# Altium project PROC114E3_SCH.PrjPcb (part 4 of 22)

## Sheet 13.SchDoc
size 513 x 386 mm
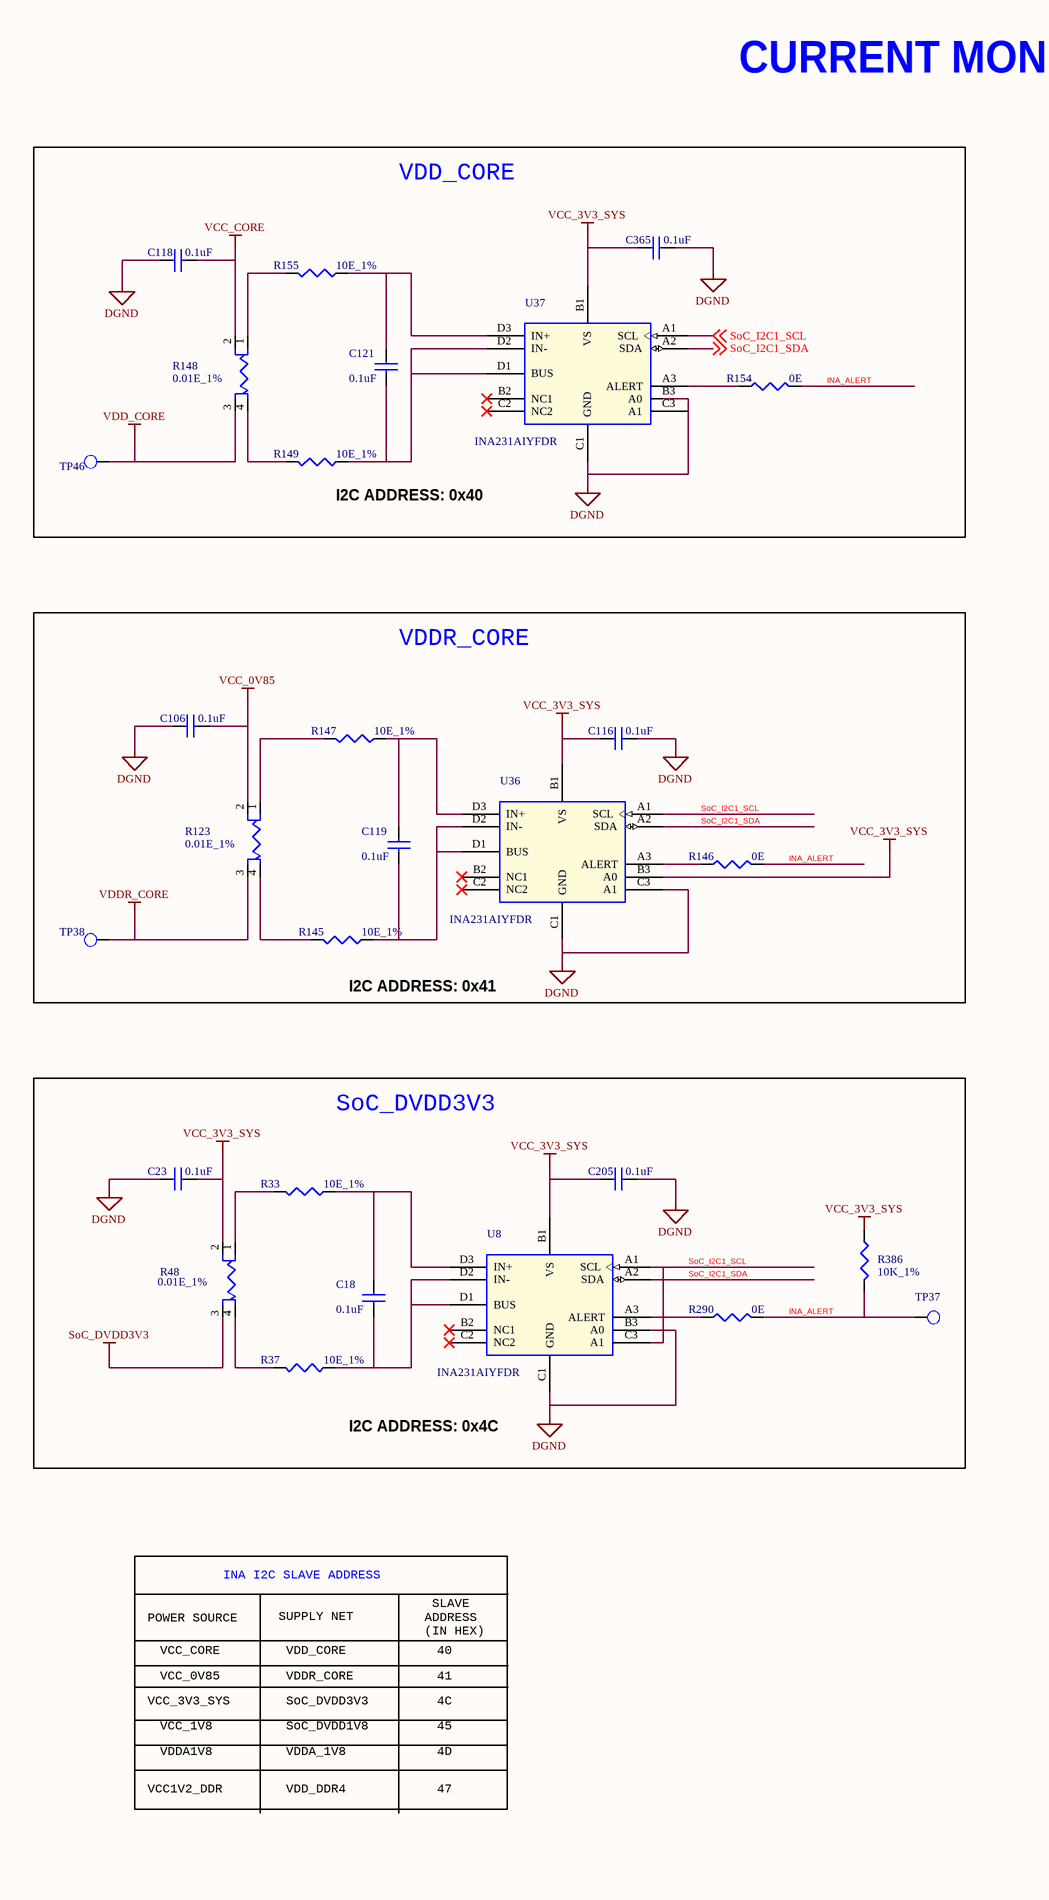
[diagram p15: 13.SchDoc, left]
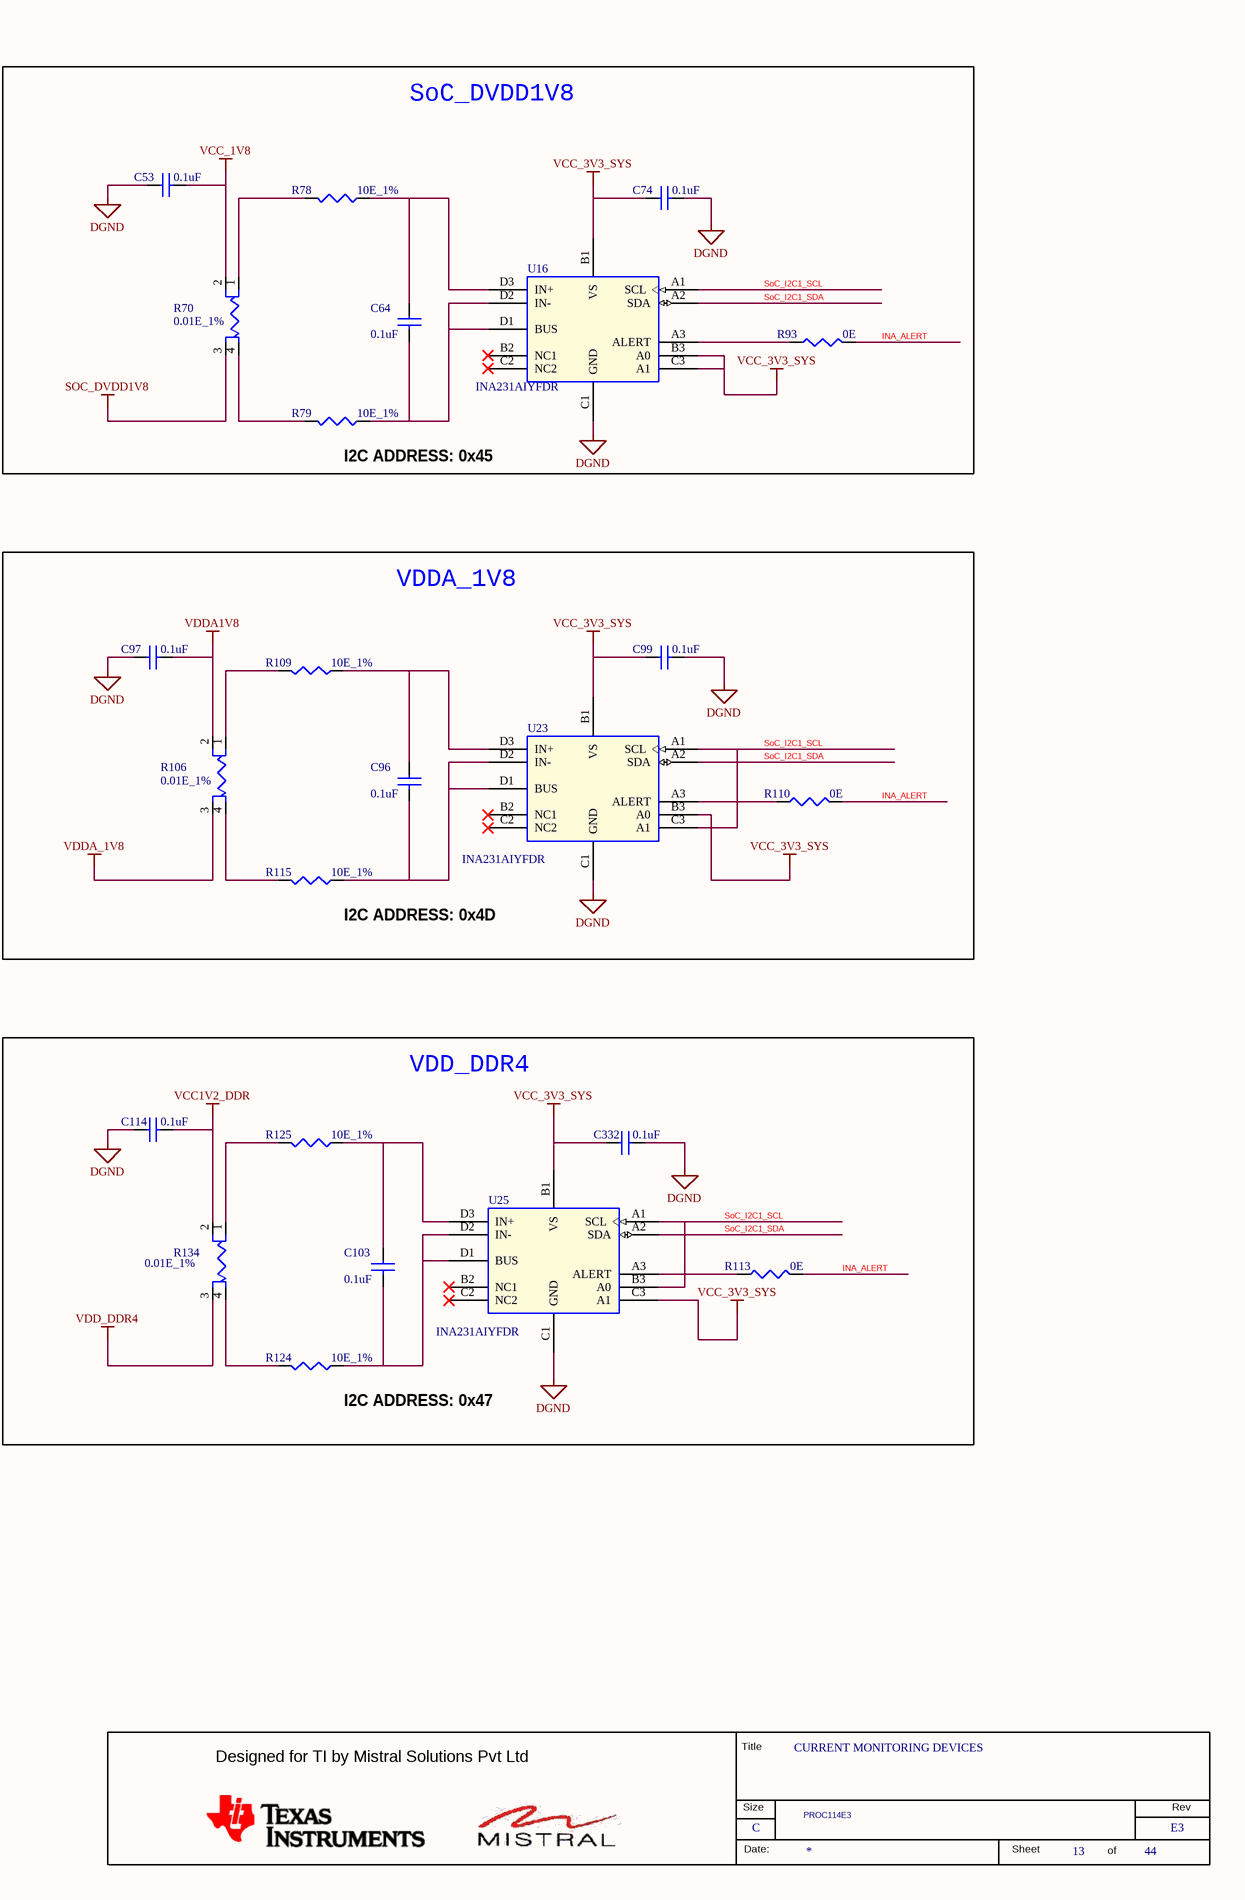
[diagram p16: 13.SchDoc, right]

### Parts
(Parts that share a designator on the sheet are numbered #1, #2 ... from top to bottom, then left to right.)
*#13  RevCode: E3  Title: CURRENT MONITORING DEVICES  Page Size: C  Page Number: 13  Page Count: 44  Variant Name: PROC114E3  (hidden comment: MISTRAL_TITLEBLK_CSIZE)  (graphical)
C18  0.1uF  [CAP0402_0-75]
C23  0.1uF  [CAP0402_0-75]
C53  0.1uF  [CAP0402_0-75]
C64  0.1uF  [CAP0402_0-75]
C74  0.1uF  [CAP0402_0-75]
C96  0.1uF  [CAP0402_0-75]
C97  0.1uF  [CAP0402_0-75]
C99  0.1uF  [CAP0402_0-75]
C103  0.1uF  [CAP0402_0-75]
C106  0.1uF  [CAP0402_0-75]
C114  0.1uF  [CAP0402_0-75]
C116  0.1uF  [CAP0402_0-75]
C118  0.1uF  [CAP0402_0-75]
C119  0.1uF  [CAP0402_0-75]
C121  0.1uF  [CAP0402_0-75]
C205  0.1uF  [CAP0402_0-75]
C332  0.1uF  [CAP0402_0-75]
C365  0.1uF  [CAP0402_0-75]
R33  10E_1%  [RES0402_0-5]
R37  10E_1%  [RES0402_0-5]
R48  0.01E_1%  [RES_KRL3216T4_1206-4_0-7]
R70  0.01E_1%  [RES_KRL3216T4_1206-4_0-7]
R78  10E_1%  [RES0402_0-5]
R79  10E_1%  [RES0402_0-5]
R93  0E  [RES0402_0-5]
R106  0.01E_1%  [RES_KRL3216T4_1206-4_0-7]
R109  10E_1%  [RES0402_0-5]
R110  0E  [RES0402_0-5]
R113  0E  [RES0402_0-5]
R115  10E_1%  [RES0402_0-5]
R123  0.01E_1%  [RES_KRL3216T4_1206-4_0-7]
R124  10E_1%  [RES0402_0-5]
R125  10E_1%  [RES0402_0-5]
R134  0.01E_1%  [RES_KRL3216T4_1206-4_0-7]
R145  10E_1%  [RES0402_0-5]
R146  0E  [RES0402_0-5]
R147  10E_1%  [RES0402_0-5]
R148  0.01E_1%  [RES_KRL3216T4_1206-4_0-7]
R149  10E_1%  [RES0402_0-5]
R154  0E  [RES0402_0-5]
R155  10E_1%  [RES0402_0-5]
R290  0E  [RES0402_0-5]
R386  10K_1%  [RES0402N]
TP37  TP20_SMD  [TP20_SMD]  (value not drawn)
TP38  TP20_SMD  [TP20_SMD]  (value not drawn)
TP46  TP20_SMD  [TP20_SMD]  (value not drawn)
U8  INA231AIYFDR  [DSBGA12_15-74_60X70_0-4]
U16  INA231AIYFDR  [DSBGA12_15-74_60X70_0-4]
U23  INA231AIYFDR  [DSBGA12_15-74_60X70_0-4]
U25  INA231AIYFDR  [DSBGA12_15-74_60X70_0-4]
U36  INA231AIYFDR  [DSBGA12_15-74_60X70_0-4]
U37  INA231AIYFDR  [DSBGA12_15-74_60X70_0-4]

### Blocks framed on the sheet
VDD_CORE: C118 C121 C365 R148 R149 R154 R155 TP46 U37
SoC_DVDD1V8: C53 C64 C74 R70 R78 R79 R93 U16
VDDR_CORE: C106 C116 C119 R123 R145-R147 TP38 U36
VDDA_1V8: C96 C97 C99 R106 R109 R110 R115 U23
SoC_DVDD3V3: C18 C23 C205 R33 R37 R48 R290 R386 TP37 U8
VDD_DDR4: C103 C114 C332 R113 R124 R125 R134 U25

### Nets
DGND: C23.1 C53.1 C74.2 C97.1 C99.2 C106.1 C114.1 C116.2 C118.1 C205.2 C332.2 C365.2 U8.B3(A0) U8.C1(GND) U16.C1(GND) U23.C1(GND) U25.C1(GND) U36.C1(GND) U36.C3(A1) U37.B3(A0) U37.C1(GND) U37.C3(A1)
SOC_DVDD1V8: R70.3
SoC_DVDD3V3: R48.3
VCC1V2_DDR: C114.2 R134.2
VCC_0V85: C106.2 R123.2
VCC_1V8: C53.2 R70.2
VCC_3V3_SYS: C23.2 C74.1 C99.1 C116.1 C205.1 C332.1 C365.1 R48.2 R386.2 U8.B1(VS) U16.B1(VS) U16.B3(A0) U16.C3(A1) U23.B1(VS) U23.B3(A0) U25.B1(VS) U25.C3(A1) U36.B1(VS) U36.B3(A0) U37.B1(VS)
VCC_CORE: C118.2 R148.2
VDD_CORE: R148.3 TP46.1(TP)
VDD_DDR4: R134.3
VDDA1V8: C97.2 R106.2
VDDA_1V8: R106.3
VDDR_CORE: R123.3 TP38.1(TP)
INA_ALERT: R93.2 R110.2 R113.2 R146.2 R154.2 R290.2 R386.1 TP37.1(TP)
SoC_I2C1_SCL: U8.A1(SCL) U8.C3(A1) U16.A1(SCL) U23.A1(SCL) U23.C3(A1) U25.A1(SCL) U25.B3(A0) U36.A1(SCL) U37.A1(SCL) ; off-sheet SoC_I2C1_SCL
SoC_I2C1_SDA: U8.A2(SDA) U16.A2(SDA) U23.A2(SDA) U25.A2(SDA) U36.A2(SDA) U37.A2(SDA) ; off-sheet SoC_I2C1_SDA
NetC18_1: C18.1 R33.1 U8.D3(IN+)
NetC18_2: C18.2 R37.1 U8.D1(BUS) U8.D2(IN-)
NetC64_1: C64.1 R78.1 U16.D3(IN+)
NetC64_2: C64.2 R79.1 U16.D1(BUS) U16.D2(IN-)
NetC96_1: C96.1 R109.1 U23.D3(IN+)
NetC96_2: C96.2 R115.1 U23.D1(BUS) U23.D2(IN-)
NetC103_1: C103.1 R125.1 U25.D3(IN+)
NetC103_2: C103.2 R124.1 U25.D1(BUS) U25.D2(IN-)
NetC119_1: C119.1 R147.1 U36.D3(IN+)
NetC119_2: C119.2 R145.1 U36.D1(BUS) U36.D2(IN-)
NetC121_1: C121.1 R155.1 U37.D3(IN+)
NetC121_2: C121.2 R149.1 U37.D1(BUS) U37.D2(IN-)
NetR33_2: R33.2 R48.1
NetR37_2: R37.2 R48.4
NetR70_1: R70.1 R78.2
NetR70_4: R70.4 R79.2
NetR93_1: R93.1 U16.A3(ALERT)
NetR106_1: R106.1 R109.2
NetR106_4: R106.4 R115.2
NetR110_1: R110.1 U23.A3(ALERT)
NetR113_1: R113.1 U25.A3(ALERT)
NetR123_1: R123.1 R147.2
NetR123_4: R123.4 R145.2
NetR124_2: R124.2 R134.4
NetR125_2: R125.2 R134.1
NetR146_1: R146.1 U36.A3(ALERT)
NetR148_1: R148.1 R155.2
NetR148_4: R148.4 R149.2
NetR154_1: R154.1 U37.A3(ALERT)
NetR290_1: R290.1 U8.A3(ALERT)

Not connected (* = marked no-connect by the designer): U8 B2(NC1)* C2(NC2)*; U16 B2(NC1)* C2(NC2)*; U23 B2(NC1)* C2(NC2)*; U25 B2(NC1)* C2(NC2)*; U36 B2(NC1)* C2(NC2)*; U37 B2(NC1)* C2(NC2)*

### Notes on the sheet
- CURRENT MONITORING DEVICES
- (near R149) I2C ADDRESS: 0x40
- (near R79) I2C ADDRESS: 0x45
- (near R145) I2C ADDRESS: 0x41
- (near R115) I2C ADDRESS: 0x4D
- I2C ADDRESS: 0x4C
- (near R124) I2C ADDRESS: 0x47
- INA I2C SLAVE ADDRESS
- SLAVE
  ADDRESS
  (IN HEX)
- POWER SOURCE
- VCC_CORE
- SUPPLY NET
- VDD_CORE
- 40
- VCC_3V3_SYS
- VCC_0V85
- VDDR_CORE
- SoC_DVDD3V3
- 41
- 4C
- VCC_1V8
- VDDA1V8
- SoC_DVDD1V8
- VDDA_1V8
- 45
- 4D
- VCC1V2_DDR
- VDD_DDR4
- 47
- (in symbol MISTRAL_TITLEBLK_CSIZE) Title; Designed for TI by Mistral Solutions Pvt Ltd; Size; Rev; Date:; Sheet; of

### Library data of the parts
*#13 = MISTRAL_TITLEBLK_CSIZE: Issue: 1.0; Page Create Date: March  8, 1995; Page Modify Date: *; Schematic Page Count: 44; Schematic Page Number: 13
C18 C23 C53 C96 C106 C114 C365 = CAP_Dup2: CAP CERAMIC 0.1uF 50V 10% X7R 0402; Alt_Mfr_part_number: CC0402KRX5R8BB104; Mistral Part No: 120011100014-R; Mfr_name: MURATA; Mfr_part_number: GRM155R71H104KE14D; Part_type: CAPACITORS\CERAMIC; Alt_Mfr_name: YAGEO AMERICA; Project: J7_CP; Wattage: NA; Customs_HS_Code: 85322990; Custom_Duty: 15%; PCB Footprint: CAP0402_0-75; Tolerance: 10%; Voltage: 50V; Package: 0402; Distributor_name: DIGIKEY; Distributor_part_number: 490-10700-1-ND; Height: 0.55MM; Weight: 3.1mg; Temperature: -55°C+125°C; Datasheet: Y:\MIS_DATABASE\DATASHEETS\CAPACITORS\GRM155R71H104KE14.PDF; Crtd /date: ALVY/211020; Chkd/date: MANIRAJA/261020; MECHANICAL 3D STEP FILE: CAP0402_0-75; Library Ref: CAP; Footprint Ref: CAP0402_0-75; Library Path: Y:\MIS_DATABASE\Library\ALTIUM_TOOL\SCHEMATICS_PARTS\MS_DISCRETE_Library.schlib; Footprint Path: Y:\MIS_DATABASE\Library\ALTIUM_TOOL\PCB_FOOTPRINTS\Altium_Footprint_Lib.PcbLib
C64 C74 C97 C99 C103 C116 C118 C119 C121 C205 C332 = CAP_Dup2: CAP CERAMIC 0.1uF 50V 10% X7R 0402; Alt_Mfr_name: YAGEO AMERICA; Part_type: CAPACITORS\CERAMIC; Mfr_part_number: GRM155R71H104KE14D; Mfr_name: MURATA; Mistral Part No: 120011100014-R; Alt_Mfr_part_number: CC0402KRX5R8BB104; Custom_Duty: 15%; Customs_HS_Code: 85322990; Wattage: NA; Project: J7_CP; PCB Footprint: CAP0402_0-75; Footprint Path: Y:\MIS_DATABASE\Library\ALTIUM_TOOL\PCB_FOOTPRINTS\Altium_Footprint_Lib.PcbLib; Library Path: Y:\MIS_DATABASE\Library\ALTIUM_TOOL\SCHEMATICS_PARTS\MS_DISCRETE_Library.schlib; Footprint Ref: CAP0402_0-75; Library Ref: CAP; MECHANICAL 3D STEP FILE: CAP0402_0-75; Chkd/date: MANIRAJA/261020; Crtd /date: ALVY/211020; Datasheet: Y:\MIS_DATABASE\DATASHEETS\CAPACITORS\GRM155R71H104KE14.PDF; Temperature: -55°C+125°C; Weight: 3.1mg; Height: 0.55MM; Distributor_part_number: 490-10700-1-ND; Distributor_name: DIGIKEY; Package: 0402; Voltage: 50V; Tolerance: 10%
R33 R37 R79 R115 R124 R147 R149 R155 = RESISTOR_Dup6: RES 10E 1/16W 1% 0402; Part_type: RESISTORS\FIXED; Mfr_part_number: RC0402FR-0710RL; Mfr_name: YAGEO AMERICA; Mistral Part No: 110018020004-R; Custom_Duty: 15%; Customs_HS_Code: 85332119; Voltage: NA; Project: TI_MAXIE_CPB; PCB Footprint: RES0402_0-5; Footprint Path: Y:\MIS_DATABASE\Library\ALTIUM_TOOL\PCB_FOOTPRINTS\Altium_Footprint_Lib.PcbLib; Library Path: Y:\MIS_DATABASE\Library\ALTIUM_TOOL\SCHEMATICS_PARTS\MS_DISCRETE_Library.schlib; Footprint Ref: RES0402_0-5; MECHANICAL 3D STEP FILE: RES0402_0-5; Chkd/date: MANIRAJA/070218; Crtd /date: ALVY/070218; Datasheet: Y:\MIS_DATABASE\DATASHEETS\RESISTORS\RCXXXXL-SER_MAR18.PDF; Temperature: -55°C+155°C; Weight: 0.65mg; Height: 0.40MM; Distributor_part_number: 311-10.0LRCT-ND; Distributor_name: DIGIKEY; Package: 0402; Wattage: 1/16W; Tolerance: 1%; Library Ref: RESISTOR
R48 R70 R106 = RESISTOR-4TERM: RES 0.01E 1W 1% 1206-4; Mistral Part No: 110018030003-R; Mfr_name: SUSUMU; Mfr_part_number: KRL3216T4A-M-R010-F-T1; Part_type: RESISTORS\FIXED; Project: GRACO SMART MODULE; Voltage: NA; Customs_HS_Code: 85332119; Custom_Duty: 15%; PCB Footprint: RES_KRL3216T4_1206-4_0-7; Library Ref: RESISTOR-4TERM; Tolerance: 1%; Wattage: 1W; Package: 1206-4; Distributor_name: DIGIKEY; Distributor_part_number: 408-1974-1-ND; Height: 0.70MM; Weight: 16.2mg; Temperature: -55°C+155°C; Datasheet: Y:\MIS_DATABASE\DATASHEETS\RESISTORS\KRL-SERIES.PDF; Crtd /date: MANIRAJA/060318; Chkd/date: MANIRAJA/060318; MECHANICAL 3D STEP FILE: RES_KRL3216T4_1206-4_0-7; Footprint Ref: RES_KRL3216T4_1206-4_0-7; Library Path: Y:\MIS_DATABASE\Library\ALTIUM_TOOL\SCHEMATICS_PARTS\MS_DISCRETE_Library.schlib; Footprint Path: Y:\MIS_DATABASE\Library\ALTIUM_TOOL\PCB_FOOTPRINTS\Altium_Footprint_Lib.PcbLib
R78 R109 R125 R145 = RESISTOR_Dup6: RES 10E 1/16W 1% 0402; Mistral Part No: 110018020004-R; Mfr_name: YAGEO AMERICA; Mfr_part_number: RC0402FR-0710RL; Part_type: RESISTORS\FIXED; Project: TI_MAXIE_CPB; Voltage: NA; Customs_HS_Code: 85332119; Custom_Duty: 15%; PCB Footprint: RES0402_0-5; Library Ref: RESISTOR; Tolerance: 1%; Wattage: 1/16W; Package: 0402; Distributor_name: DIGIKEY; Distributor_part_number: 311-10.0LRCT-ND; Height: 0.40MM; Weight: 0.65mg; Temperature: -55°C+155°C; Datasheet: Y:\MIS_DATABASE\DATASHEETS\RESISTORS\RCXXXXL-SER_MAR18.PDF; Crtd /date: ALVY/070218; Chkd/date: MANIRAJA/070218; MECHANICAL 3D STEP FILE: RES0402_0-5; Footprint Ref: RES0402_0-5; Library Path: Y:\MIS_DATABASE\Library\ALTIUM_TOOL\SCHEMATICS_PARTS\MS_DISCRETE_Library.schlib; Footprint Path: Y:\MIS_DATABASE\Library\ALTIUM_TOOL\PCB_FOOTPRINTS\Altium_Footprint_Lib.PcbLib
R93 R113 = RESISTOR_Dup4: RES 0E 1/16W JUMPER 0402; Part_type: RESISTORS\FIXED; Mfr_part_number: CRCW04020000Z0ED; Mfr_name: VISHAY; Mistral Part No: 110010080019-R; Custom_Duty: 15%; Customs_HS_Code: 85332119; Voltage: NA; Project: PB_BUGBASE; PCB Footprint: RES0402_0-5; Footprint Path: Y:\MIS_DATABASE\Library\ALTIUM_TOOL\PCB_FOOTPRINTS\Altium_Footprint_Lib.PcbLib; Library Path: Y:\MIS_DATABASE\Library\ALTIUM_TOOL\SCHEMATICS_PARTS\MS_DISCRETE_Library.schlib; Footprint Ref: RES0402_0-5; Library Ref: RESISTOR; Chkd/date: VASANTHA/201216; Crtd /date: MUDDU/190810; Datasheet: Y:\MIS_DATABASE\DATASHEETS\RESISTORS\CRCW0603.PDF; Temperature: -55°C+155°C; Weight: 0.65mg; Height: 0.40MM; Distributor_part_number: 541-0.0JCT-ND; Distributor_name: DIGIKEY; Package: 0402; Wattage: 1/16W; Tolerance: NA; MECHANICAL 3D STEP FILE: RES0402_0-5
R110 R146 R154 R290 = RESISTOR_Dup4: RES 0E 1/16W JUMPER 0402; Mistral Part No: 110010080019-R; Mfr_name: VISHAY; Mfr_part_number: CRCW04020000Z0ED; Part_type: RESISTORS\FIXED; Project: PB_BUGBASE; Tolerance: NA; Customs_HS_Code: 85332119; Custom_Duty: 15%; PCB Footprint: RES0402_0-5; MECHANICAL 3D STEP FILE: RES0402_0-5; Voltage: NA; Wattage: 1/16W; Package: 0402; Distributor_name: DIGIKEY; Distributor_part_number: 541-0.0JCT-ND; Height: 0.40MM; Weight: 0.65mg; Temperature: -55°C+155°C; Datasheet: Y:\MIS_DATABASE\DATASHEETS\RESISTORS\CRCW0603.PDF; Crtd /date: MUDDU/190810; Chkd/date: VASANTHA/201216; Library Ref: RESISTOR; Footprint Ref: RES0402_0-5; Library Path: Y:\MIS_DATABASE\Library\ALTIUM_TOOL\SCHEMATICS_PARTS\MS_DISCRETE_Library.schlib; Footprint Path: Y:\MIS_DATABASE\Library\ALTIUM_TOOL\PCB_FOOTPRINTS\Altium_Footprint_Lib.PcbLib
R123 R134 R148 = RESISTOR-4TERM: RES 0.01E 1W 1% 1206-4; Part_type: RESISTORS\FIXED; Mfr_part_number: KRL3216T4A-M-R010-F-T1; Mfr_name: SUSUMU; Mistral Part No: 110018030003-R; Custom_Duty: 15%; Customs_HS_Code: 85332119; Voltage: NA; Project: GRACO SMART MODULE; PCB Footprint: RES_KRL3216T4_1206-4_0-7; Footprint Path: Y:\MIS_DATABASE\Library\ALTIUM_TOOL\PCB_FOOTPRINTS\Altium_Footprint_Lib.PcbLib; Library Path: Y:\MIS_DATABASE\Library\ALTIUM_TOOL\SCHEMATICS_PARTS\MS_DISCRETE_Library.schlib; Footprint Ref: RES_KRL3216T4_1206-4_0-7; MECHANICAL 3D STEP FILE: RES_KRL3216T4_1206-4_0-7; Chkd/date: MANIRAJA/060318; Crtd /date: MANIRAJA/060318; Datasheet: Y:\MIS_DATABASE\DATASHEETS\RESISTORS\KRL-SERIES.PDF; Temperature: -55°C+155°C; Weight: 16.2mg; Height: 0.70MM; Distributor_part_number: 408-1974-1-ND; Distributor_name: DIGIKEY; Package: 1206-4; Wattage: 1W; Tolerance: 1%; Library Ref: RESISTOR-4TERM
R386 = RESISTOR_Dup3: RES 10K 1/20W 1% 0201; Part_type: RESISTORS\FIXED; Mfr_part_number: RC0201FR-0710KL; Mfr_name: YAGEO AMERICA; Mistral Part No: 110011040018-R; PCB Footprint: RES0201_0-5; Voltage: NA; Custom_Duty: 15%; Customs_HS_Code: 85332119; Project: GOLDEN-I LITE; Footprint Path: Y:\MIS_DATABASE\Library\ALTIUM_TOOL\PCB_FOOTPRINTS\Altium_Footprint_Lib.PcbLib; Library Path: Y:\MIS_DATABASE\Library\ALTIUM_TOOL\SCHEMATICS_PARTS\MS_DISCRETE_Library.schlib; Footprint Ref: RES0201_0-5; Library Ref: RESISTOR; MECHANICAL 3D STEP FILE: RES0201_0-5; Temperature: -55°C+125°C; Weight: 0.17mg; Chkd/date: VASANTHA/270117; Crtd /date: MANIRAJA/270117; Datasheet: Y:\MIS_DATABASE\DATASHEETS\RESISTORS\RCXXXXL-SER_MAR18.PDF; Height: 0.26MM; Distributor_part_number: 311-10.0KMCT-ND; Distributor_name: DIGIKEY; Package: 0201; Wattage: 1/20W; Tolerance: 1%
TP37 TP38 TP46 = TESTPOINT: TESTPOINT CIR 20 SMD; Mfr_name: LOCAL; Custom_Duty: NA; Project: BT MODULE_CSRBC04; PCB Footprint: TP20_SMD; Customs_HS_Code: NA; Chkd/date: SHREESHAIL/171006; Crtd /date: MAZHAR/171006; Height: NA; Distributor_part_number: NA; Distributor_name: NA; Package: SMD; Part_type: TESTPOINT; Mfr_part_number: TP20_SMD; Mistral Part No: NA; Tolerance: NA; Voltage: NA; Wattage: NA; Weight: NA; Temperature: NA; Datasheet: NA; MECHANICAL 3D STEP FILE: NA; Library Path: Y:\MIS_DATABASE\Library\ALTIUM_TOOL\SCHEMATICS_PARTS\MS_DISCRETE_Library.schlib; Footprint Path: Y:\MIS_DATABASE\Library\ALTIUM_TOOL\PCB_FOOTPRINTS\Altium_Footprint_Lib.PcbLib; Library Ref: TESTPOINT; Footprint Ref: TP20_SMD; RoHS: NA
U8 U23 U36 U37 = INA231_DSBGA12: IC HIGH OR LOW SIDE MEASUREMENT BI-DIR CURRENT AND POWER MONITOR WITH 1.8V I2C INTERFACE DSBGA12; Part_type: ICS\POWER\MANAGEMENT; Mfr_name: TEXAS INSTRUMENTS; Mistral Part No: 142021080022-R; Custom_Duty: 15%; Customs_HS_Code: 85423100; Wattage: NA; Project: TI_AM62x SVB_BRD; PCB Footprint: DSBGA12_15-74_60X70_0-4; Footprint Path: Y:\MIS_DATABASE\Library\ALTIUM_TOOL\PCB_FOOTPRINTS\Altium_Footprint_Lib.PcbLib; Library Path: Y:\MIS_DATABASE\Library\ALTIUM_TOOL\SCHEMATICS_PARTS\MS_MISCPOWER_Library.schlib; MECHANICAL 3D STEP FILE: DSBGA12_15-74_60X70_0-4; Chkd/date: MANIRAJA/250821; Crtd /date: ALVY/250821; Datasheet: Y:\MIS_DATABASE\DATASHEETS\ICS\POWER\INA231XXX.PDF; Temperature: -40°C+125°C; Weight: 200mg; Height: 0.40MM; Library Ref: INA231_DSBGA12; Distributor_part_number: 296-49645-1-ND; Distributor_name: DIGIKEY; Package: DSBGA12; Voltage: NA; Tolerance: NA; Mfr_part_number: INA231AIYFDR; Footprint Ref: DSBGA12_15-74_60X70_0-4
U16 U25 = INA231_DSBGA12: IC HIGH OR LOW SIDE MEASUREMENT BI-DIR CURRENT AND POWER MONITOR WITH 1.8V I2C INTERFACE DSBGA12; Mistral Part No: 142021080022-R; Mfr_name: TEXAS INSTRUMENTS; Part_type: ICS\POWER\MANAGEMENT; Project: TI_AM62x SVB_BRD; Tolerance: NA; Customs_HS_Code: 85423100; Custom_Duty: 15%; Footprint Ref: DSBGA12_15-74_60X70_0-4; Mfr_part_number: INA231AIYFDR; Voltage: NA; Wattage: NA; Package: DSBGA12; Distributor_name: DIGIKEY; Distributor_part_number: 296-49645-1-ND; Library Ref: INA231_DSBGA12; Height: 0.40MM; Weight: 200mg; Temperature: -40°C+125°C; Datasheet: Y:\MIS_DATABASE\DATASHEETS\ICS\POWER\INA231XXX.PDF; Crtd /date: ALVY/250821; Chkd/date: MANIRAJA/250821; MECHANICAL 3D STEP FILE: DSBGA12_15-74_60X70_0-4; Library Path: Y:\MIS_DATABASE\Library\ALTIUM_TOOL\SCHEMATICS_PARTS\MS_MISCPOWER_Library.schlib; Footprint Path: Y:\MIS_DATABASE\Library\ALTIUM_TOOL\PCB_FOOTPRINTS\Altium_Footprint_Lib.PcbLib; PCB Footprint: DSBGA12_15-74_60X70_0-4

## Sheet 14.SchDoc
size 513 x 386 mm
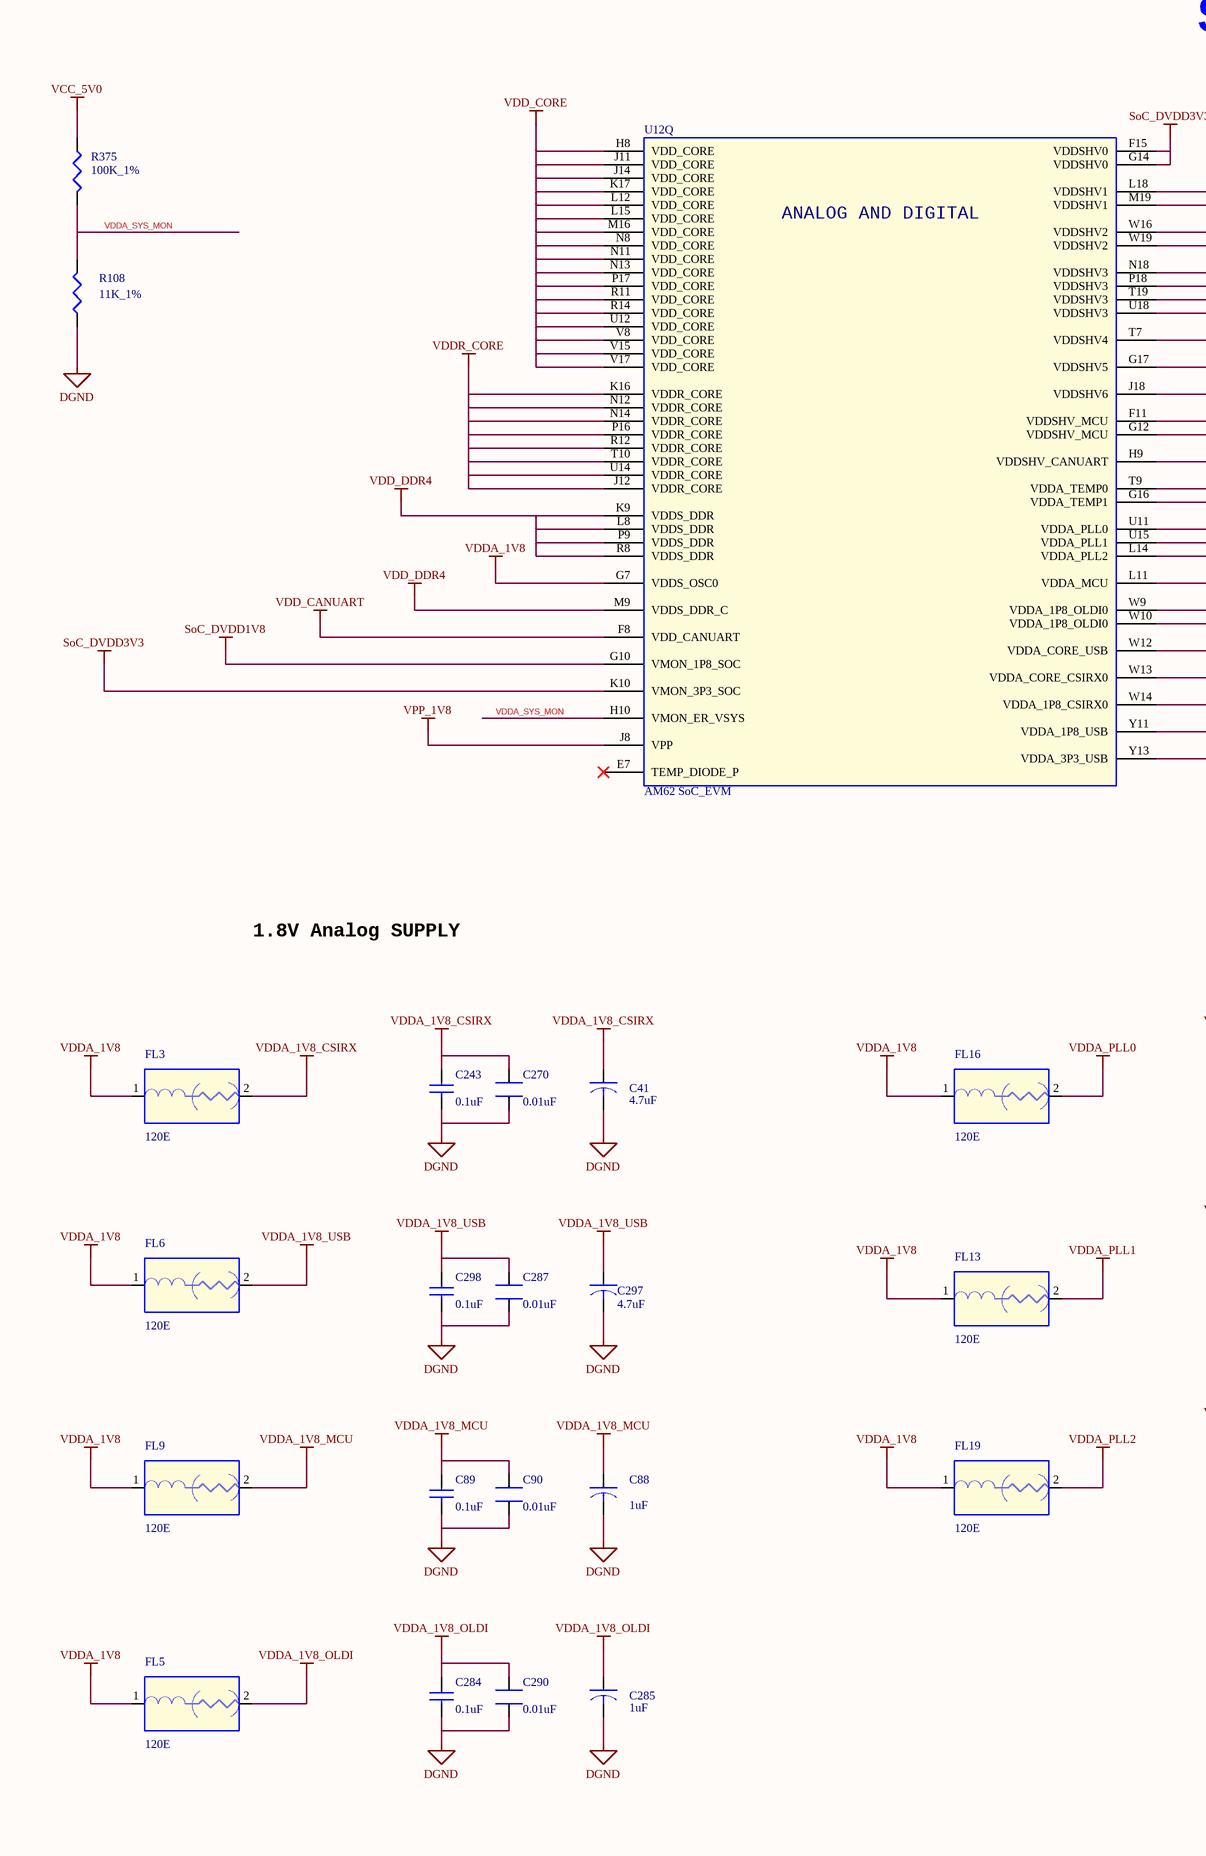
[diagram p17: 14.SchDoc, left]
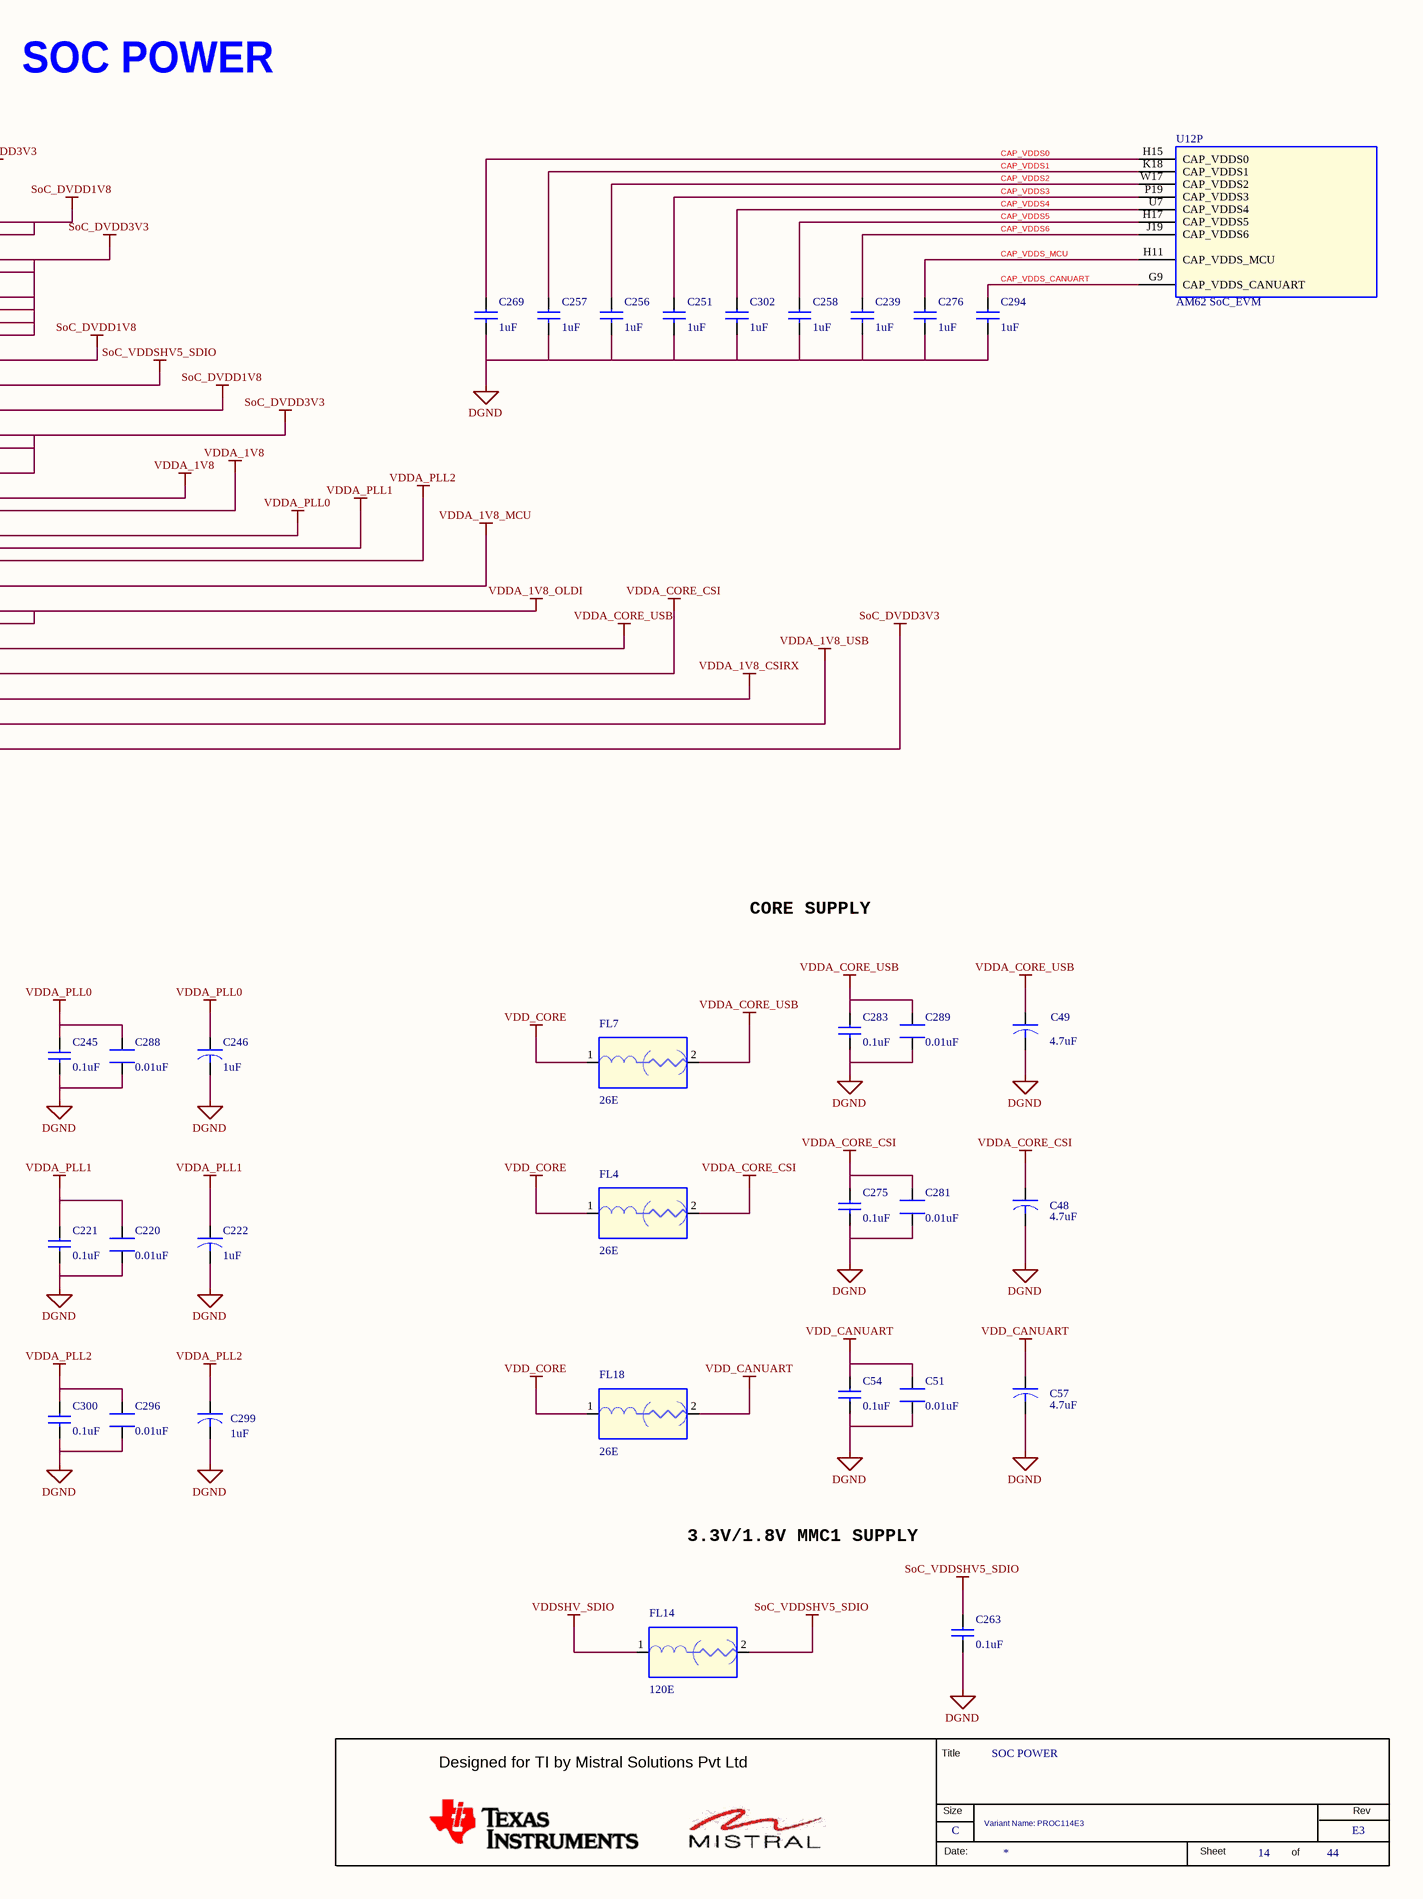
[diagram p18: 14.SchDoc, right]

### Parts
(Parts that share a designator on the sheet are numbered #1, #2 ... from top to bottom, then left to right.)
*#14  RevCode: E3  Title: SOC POWER  Page Size: C  Page Number: 14  Page Count: 44  Variant Name: PROC114E3  (hidden comment: MISTRAL_TITLEBLK_CSIZE)  (graphical)
C41  4.7uF  [CAP0402_0-75]
C48  4.7uF  [CAP0402_0-75]
C49  4.7uF  [CAP0402_0-75]
C51  0.01uF  [CAP0402N]
C54  0.1uF  [CAP0201_0-5]
C57  4.7uF  [CAP0402_0-75]
C88  1uF  [CAP0201_0-5]
C89  0.1uF  [CAP0201_0-5]
C90  0.01uF  [CAP0402N]
C220  0.01uF  [CAP0402N]
C221  0.1uF  [CAP0201_0-5]
C222  1uF  [CAP0201_0-5]
C239  1uF  [CAP0201_0-5]
C243  0.1uF  [CAP0201_0-5]
C245  0.1uF  [CAP0201_0-5]
C246  1uF  [CAP0201_0-5]
C251  1uF  [CAP0201_0-5]
C256  1uF  [CAP0201_0-5]
C257  1uF  [CAP0201_0-5]
C258  1uF  [CAP0201_0-5]
C263  0.1uF  [CAP0201_0-5]
C269  1uF  [CAP0201_0-5]
C270  0.01uF  [CAP0402N]
C275  0.1uF  [CAP0201_0-5]
C276  1uF  [CAP0201_0-5]
C281  0.01uF  [CAP0402N]
C283  0.1uF  [CAP0201_0-5]
C284  0.1uF  [CAP0201_0-5]
C285  1uF  [CAP0201_0-5]
C287  0.01uF  [CAP0402N]
C288  0.01uF  [CAP0402N]
C289  0.01uF  [CAP0402N]
C290  0.01uF  [CAP0402N]
C294  1uF  [CAP0201_0-5]
C296  0.01uF  [CAP0402N]
C297  4.7uF  [CAP0402_0-75]
C298  0.1uF  [CAP0201_0-5]
C299  1uF  [CAP0201_0-5]
C300  0.1uF  [CAP0201_0-5]
C302  1uF  [CAP0201_0-5]
FL3  120E  [EMIFIL_BLM15A_0402_0-6]
FL4  26E  [EMIFIL_BLM18K_0603_0-7]
FL5  120E  [EMIFIL_BLM15A_0402_0-6]
FL6  120E  [EMIFIL_BLM15A_0402_0-6]
FL7  26E  [EMIFIL_BLM18K_0603_0-7]
FL9  120E  [EMIFIL_BLM15A_0402_0-6]
FL13  120E  [EMIFIL_BLM15A_0402_0-6]
FL14  120E  [EMIFIL_BLM15A_0402_0-6]
FL16  120E  [EMIFIL_BLM15A_0402_0-6]
FL18  26E  [EMIFIL_BLM18K_0603_0-7]
FL19  120E  [EMIFIL_BLM15A_0402_0-6]
R108  11K_1%  [RES0402_0-5]
R375  100K_1%  [RES0402_0-5]
U12#1  AM62 SoC_EVM  [BGA425_19-68_510X510_0-7]  (part P of 18)
U12#2  AM62 SoC_EVM  [BGA425_19-68_510X510_0-7]  (part Q of 18)

### Nets
DGND: C41.2 C48.2 C49.2 C51.2 C54.2 C57.2 C88.2 C89.2 C90.2 C220.2 C221.2 C222.2 C239.2 C243.2 C245.2 C246.2 C251.2 C256.2 C257.2 C258.2 C263.2 C269.2 C270.2 C275.2 C276.2 C281.2 C283.2 C284.2 C285.2 C287.2 C288.2 C289.2 C290.2 C294.2 C296.2 C297.2 C298.2 C299.2 C300.2 C302.2 R108.2
SOC_DVDD1V8: U12#2.G10(VMON_1P8_SOC) U12#2.J18(VDDSHV6) U12#2.L18(VDDSHV1) U12#2.M19(VDDSHV1) U12#2.T7(VDDSHV4)
SoC_DVDD3V3: U12#2.F11(VDDSHV_MCU) U12#2.F15(VDDSHV0) U12#2.G12(VDDSHV_MCU) U12#2.G14(VDDSHV0) U12#2.H9(VDDSHV_CANUART) U12#2.K10(VMON_3P3_SOC) U12#2.N18(VDDSHV3) U12#2.P18(VDDSHV3) U12#2.T19(VDDSHV3) U12#2.U18(VDDSHV3) U12#2.W16(VDDSHV2) U12#2.W19(VDDSHV2) U12#2.Y13(VDDA_3P3_USB)
SoC_VDDSHV5_SDIO: C263.1 FL14.2 U12#2.G17(VDDSHV5)
VCC_5V0: R375.1
VDD_CANUART: C51.1 C54.1 C57.1 FL18.2 U12#2.F8(VDD_CANUART)
VDD_CORE: FL4.1 FL7.1 FL18.1 U12#2.H8(VDD_CORE) U12#2.J11(VDD_CORE) U12#2.J14(VDD_CORE) U12#2.K17(VDD_CORE) U12#2.L12(VDD_CORE) U12#2.L15(VDD_CORE) U12#2.M16(VDD_CORE) U12#2.N8(VDD_CORE) U12#2.N11(VDD_CORE) U12#2.N13(VDD_CORE) U12#2.P17(VDD_CORE) U12#2.R11(VDD_CORE) U12#2.R14(VDD_CORE) U12#2.U12(VDD_CORE) U12#2.V8(VDD_CORE) U12#2.V15(VDD_CORE) U12#2.V17(VDD_CORE)
VDD_DDR4: U12#2.K9(VDDS_DDR) U12#2.L8(VDDS_DDR) U12#2.M9(VDDS_DDR_C) U12#2.P9(VDDS_DDR) U12#2.R8(VDDS_DDR)
VDDA_1V8: FL3.1 FL5.1 FL6.1 FL9.1 FL13.1 FL16.1 FL19.1 U12#2.G7(VDDS_OSC0) U12#2.G16(VDDA_TEMP1) U12#2.T9(VDDA_TEMP0)
VDDA_1V8_CSIRX: C41.1 C243.1 C270.1 FL3.2 U12#2.W14(VDDA_1P8_CSIRX0)
VDDA_1V8_MCU: C88.1 C89.1 C90.1 FL9.2 U12#2.L11(VDDA_MCU)
VDDA_1V8_OLDI: C284.1 C285.1 C290.1 FL5.2 U12#2.W9(VDDA_1P8_OLDI0) U12#2.W10(VDDA_1P8_OLDI0)
VDDA_1V8_USB: C287.1 C297.1 C298.1 FL6.2 U12#2.Y11(VDDA_1P8_USB)
VDDA_CORE_CSI: C48.1 C275.1 C281.1 FL4.2 U12#2.W13(VDDA_CORE_CSIRX0)
VDDA_CORE_USB: C49.1 C283.1 C289.1 FL7.2 U12#2.W12(VDDA_CORE_USB)
VDDA_PLL0: C245.1 C246.1 C288.1 FL16.2 U12#2.U11(VDDA_PLL0)
VDDA_PLL1: C220.1 C221.1 C222.1 FL13.2 U12#2.U15(VDDA_PLL1)
VDDA_PLL2: C296.1 C299.1 C300.1 FL19.2 U12#2.L14(VDDA_PLL2)
VDDR_CORE: U12#2.J12(VDDR_CORE) U12#2.K16(VDDR_CORE) U12#2.N12(VDDR_CORE) U12#2.N14(VDDR_CORE) U12#2.P16(VDDR_CORE) U12#2.R12(VDDR_CORE) U12#2.T10(VDDR_CORE) U12#2.U14(VDDR_CORE)
VDDSHV_SDIO: FL14.1
VPP_1V8: U12#2.J8(VPP)
CAP_VDDS0: C269.1 U12#1.H15(CAP_VDDS0)
CAP_VDDS1: C257.1 U12#1.K18(CAP_VDDS1)
CAP_VDDS2: C256.1 U12#1.W17(CAP_VDDS2)
CAP_VDDS3: C251.1 U12#1.P19(CAP_VDDS3)
CAP_VDDS4: C302.1 U12#1.U7(CAP_VDDS4)
CAP_VDDS5: C258.1 U12#1.H17(CAP_VDDS5)
CAP_VDDS6: C239.1 U12#1.J19(CAP_VDDS6)
CAP_VDDS_CANUART: C294.1 U12#1.G9(CAP_VDDS_CANUART)
CAP_VDDS_MCU: C276.1 U12#1.H11(CAP_VDDS_MCU)
VDDA_SYS_MON: R108.1 R375.2 U12#2.H10(VMON_ER_VSYS)

Not connected (* = marked no-connect by the designer): U12#2 E7(TEMP_DIODE_P)*

### Notes on the sheet
- SOC POWER
- 1.8V Analog SUPPLY
- CORE SUPPLY
- 3.3V/1.8V MMC1 SUPPLY
- (in symbol AM62-EVM_BGA425, part Q) ANALOG AND DIGITAL
- (in symbol MISTRAL_TITLEBLK_CSIZE) Title; Designed for TI by Mistral Solutions Pvt Ltd; Size; Rev; Date:; Sheet; of

### Library data of the parts
*#14 = MISTRAL_TITLEBLK_CSIZE: Issue: 1.0; Page Create Date: March  8, 1995; Page Modify Date: *; Schematic Page Count: 44; Schematic Page Number: 14
C41 = CAP_Dup1: CAP CERAMIC 4.7uF 10V 20% X5R 0402; Part_type: CAPACITORS\CERAMIC; Mfr_part_number: GRM155R61A475MEAAD; Mfr_name: MURATA; Mistral Part No: 120012060002-R; Custom_Duty: 15%; Customs_HS_Code: 85322990; Wattage: NA; Project: TI_J7SVB_PCIE_ADD-ON-CARD; Footprint Path: Y:\MIS_DATABASE\Library\ALTIUM_TOOL\PCB_FOOTPRINTS\Altium_Footprint_Lib.PcbLib; Library Path: Y:\MIS_DATABASE\Library\ALTIUM_TOOL\SCHEMATICS_PARTS\MS_DISCRETE_Library.schlib; MECHANICAL 3D STEP FILE: CAP0402_0-75; Chkd/date: MANIRAJA/110718; Crtd /date: ALVY/110718; Datasheet: Y:\MIS_DATABASE\DATASHEETS\CAPACITORS\GRM155R61A475MEAAD.PDF; Temperature: -55°C+85°C; Weight: 14mg; Height: 0.65MM; Library Ref: CAP; Distributor_part_number: 490-14306-1-ND; Distributor_name: DIGIKEY; Package: 0402; Voltage: 10V; Tolerance: 20%; Footprint Ref: CAP0402_0-75; PCB Footprint: CAP0402_0-75
C48 C49 C57 C297 = CAP_Dup1: CAP CERAMIC 4.7uF 10V 20% X5R 0402; Mistral Part No: 120012060002-R; Mfr_name: MURATA; Mfr_part_number: GRM155R61A475MEAAD; Part_type: CAPACITORS\CERAMIC; Project: TI_J7SVB_PCIE_ADD-ON-CARD; Wattage: NA; Customs_HS_Code: 85322990; Custom_Duty: 15%; PCB Footprint: CAP0402_0-75; Footprint Ref: CAP0402_0-75; Tolerance: 20%; Voltage: 10V; Package: 0402; Distributor_name: DIGIKEY; Distributor_part_number: 490-14306-1-ND; Library Ref: CAP; Height: 0.65MM; Weight: 14mg; Temperature: -55°C+85°C; Datasheet: Y:\MIS_DATABASE\DATASHEETS\CAPACITORS\GRM155R61A475MEAAD.PDF; Crtd /date: ALVY/110718; Chkd/date: MANIRAJA/110718; MECHANICAL 3D STEP FILE: CAP0402_0-75; Library Path: Y:\MIS_DATABASE\Library\ALTIUM_TOOL\SCHEMATICS_PARTS\MS_DISCRETE_Library.schlib; Footprint Path: Y:\MIS_DATABASE\Library\ALTIUM_TOOL\PCB_FOOTPRINTS\Altium_Footprint_Lib.PcbLib
C51 C288 = CAP_Dup3: CAP CERAMIC 0.01uF 25V 10% X5R 0201; Part_type: CAPACITORS\CERAMIC; Mfr_part_number: GRM033R61E103KA12J; Mfr_name: MURATA; Mistral Part No: 120018010007-R; PCB Footprint: CAP0201_0-5; Wattage: NA; Custom_Duty: 15%; Customs_HS_Code: 85322990; Project: TI_MAXIE_CPB; Footprint Path: Y:\MIS_DATABASE\Library\ALTIUM_TOOL\PCB_FOOTPRINTS\Altium_Footprint_Lib.PcbLib; Library Path: Y:\MIS_DATABASE\Library\ALTIUM_TOOL\SCHEMATICS_PARTS\MS_DISCRETE_Library.schlib; Footprint Ref: CAP0201_0-5; Library Ref: CAP; MECHANICAL 3D STEP FILE: CAP0201_0-5; Temperature: -55°C+85°C; Weight: 0.33mg; Chkd/date: MANIRAJA/230118; Crtd /date: MANIRAJA/230118; Datasheet: Y:\MIS_DATABASE\DATASHEETS\CAPACITORS\GRM033R61E103KA12.PDF; Height: 0.33MM; Distributor_part_number: GRM033R61E103KA12J-ND; Distributor_name: DIGIKEY; Package: 0201; Voltage: 25V; Tolerance: 10%
C54 C89 C243 C245 C275 C283 C284 C298 = CAP_Dup2: CAP CERAMIC 0.1uF 16V 10% X5R 0201; Part_type: CAPACITORS\CERAMIC; Mfr_part_number: GRM033R61C104KE14D; Mfr_name: MURATA; Mistral Part No: 120009030072-R; Custom_Duty: 15%; Customs_HS_Code: 85322990; Wattage: NA; Project: TI_MAXIE_CPB; PCB Footprint: CAP0201_0-5; Footprint Path: Y:\MIS_DATABASE\Library\ALTIUM_TOOL\PCB_FOOTPRINTS\Altium_Footprint_Lib.PcbLib; Library Path: Y:\MIS_DATABASE\Library\ALTIUM_TOOL\SCHEMATICS_PARTS\MS_DISCRETE_Library.schlib; Footprint Ref: CAP0201_0-5; MECHANICAL 3D STEP FILE: CAP0201_0-5; Chkd/date: MANIRAJA/230118; Crtd /date: MANIRAJA/230118; Datasheet: Y:\MIS_DATABASE\DATASHEETS\CAPACITORS\GRM033R61C104KE14.PDF; Temperature: -55°C+85°C; Weight: 0.33mg; Height: 0.33MM; Distributor_part_number: 490-14305-1-ND; Distributor_name: DIGIKEY; Package: 0201; Voltage: 16V; Tolerance: 10%; Library Ref: CAP
C88 C222 C285 C299 = CAP_Dup1: CAP CERAMIC 1uF 16V 20% X5R 0201; Part_type: CAPACITORS\CERAMIC; Mfr_part_number: GRM033R61C105ME15D; Mfr_name: MURATA; Mistral Part No: 120018090038-R; Custom_Duty: 15%; Customs_HS_Code: 85322990; Wattage: NA; Project: QCS610_NANOSOM; PCB Footprint: CAP0201_0-5; Footprint Path: Y:\MIS_DATABASE\Library\ALTIUM_TOOL\PCB_FOOTPRINTS\Altium_Footprint_Lib.PcbLib; Library Path: Y:\MIS_DATABASE\Library\ALTIUM_TOOL\SCHEMATICS_PARTS\MS_DISCRETE_Library.schlib; MECHANICAL 3D STEP FILE: CAP0201_0-5; Chkd/date: MANIRAJA/300520; Crtd /date: ALVY/260520; Datasheet: Y:\MIS_DATABASE\DATASHEETS\CAPACITORS\GRM033R61C105ME15.PDF; Temperature: -55°C+85°C; Weight: 0.33mg; Height: 0.39MM; Library Ref: CAP; Distributor_part_number: 490-18654-1-ND; Distributor_name: DIGIKEY; Package: 0201; Voltage: 16V; Tolerance: 20%; Footprint Ref: CAP0201_0-5
C90 C220 C270 C281 C287 C289 C290 C296 = CAP_Dup3: CAP CERAMIC 0.01uF 25V 10% X5R 0201; Mistral Part No: 120018010007-R; Mfr_name: MURATA; Mfr_part_number: GRM033R61E103KA12J; Part_type: CAPACITORS\CERAMIC; PCB Footprint: CAP0201_0-5; Project: TI_MAXIE_CPB; Customs_HS_Code: 85322990; Custom_Duty: 15%; Wattage: NA; Footprint Path: Y:\MIS_DATABASE\Library\ALTIUM_TOOL\PCB_FOOTPRINTS\Altium_Footprint_Lib.PcbLib; Library Path: Y:\MIS_DATABASE\Library\ALTIUM_TOOL\SCHEMATICS_PARTS\MS_DISCRETE_Library.schlib; Footprint Ref: CAP0201_0-5; Tolerance: 10%; Voltage: 25V; Package: 0201; Distributor_name: DIGIKEY; Distributor_part_number: GRM033R61E103KA12J-ND; Height: 0.33MM; Datasheet: Y:\MIS_DATABASE\DATASHEETS\CAPACITORS\GRM033R61E103KA12.PDF; Crtd /date: MANIRAJA/230118; Chkd/date: MANIRAJA/230118; Weight: 0.33mg; Temperature: -55°C+85°C; MECHANICAL 3D STEP FILE: CAP0201_0-5; Library Ref: CAP
C221 C263 C300 = CAP_Dup2: CAP CERAMIC 0.1uF 16V 10% X5R 0201; Mistral Part No: 120009030072-R; Mfr_name: MURATA; Mfr_part_number: GRM033R61C104KE14D; Part_type: CAPACITORS\CERAMIC; Project: TI_MAXIE_CPB; Wattage: NA; Customs_HS_Code: 85322990; Custom_Duty: 15%; PCB Footprint: CAP0201_0-5; Tolerance: 10%; Voltage: 16V; Package: 0201; Distributor_name: DIGIKEY; Distributor_part_number: 490-14305-1-ND; Height: 0.33MM; Weight: 0.33mg; Temperature: -55°C+85°C; Datasheet: Y:\MIS_DATABASE\DATASHEETS\CAPACITORS\GRM033R61C104KE14.PDF; Crtd /date: MANIRAJA/230118; Chkd/date: MANIRAJA/230118; MECHANICAL 3D STEP FILE: CAP0201_0-5; Library Ref: CAP; Footprint Ref: CAP0201_0-5; Library Path: Y:\MIS_DATABASE\Library\ALTIUM_TOOL\SCHEMATICS_PARTS\MS_DISCRETE_Library.schlib; Footprint Path: Y:\MIS_DATABASE\Library\ALTIUM_TOOL\PCB_FOOTPRINTS\Altium_Footprint_Lib.PcbLib
C239 C251 C257 C294 C302 = CAP_Dup2: CAP CERAMIC 1uF 16V 20% X5R 0201; Mistral Part No: 120018090038-R; Mfr_name: MURATA; Mfr_part_number: GRM033R61C105ME15D; Part_type: CAPACITORS\CERAMIC; Project: QCS610_NANOSOM; Wattage: NA; Customs_HS_Code: 85322990; Custom_Duty: 15%; PCB Footprint: CAP0201_0-5; Footprint Ref: CAP0201_0-5; Tolerance: 20%; Voltage: 16V; Package: 0201; Distributor_name: DIGIKEY; Distributor_part_number: 490-18654-1-ND; Library Ref: CAP; Height: 0.39MM; Weight: 0.33mg; Temperature: -55°C+85°C; Datasheet: Y:\MIS_DATABASE\DATASHEETS\CAPACITORS\GRM033R61C105ME15.PDF; Crtd /date: ALVY/260520; Chkd/date: MANIRAJA/300520; MECHANICAL 3D STEP FILE: CAP0201_0-5; Library Path: Y:\MIS_DATABASE\Library\ALTIUM_TOOL\SCHEMATICS_PARTS\MS_DISCRETE_Library.schlib; Footprint Path: Y:\MIS_DATABASE\Library\ALTIUM_TOOL\PCB_FOOTPRINTS\Altium_Footprint_Lib.PcbLib
C246 = CAP_Dup1: CAP CERAMIC 1uF 16V 20% X5R 0201; Mistral Part No: 120018090038-R; Mfr_name: MURATA; Mfr_part_number: GRM033R61C105ME15D; Part_type: CAPACITORS\CERAMIC; Project: QCS610_NANOSOM; Wattage: NA; Customs_HS_Code: 85322990; Custom_Duty: 15%; PCB Footprint: CAP0201_0-5; Footprint Ref: CAP0201_0-5; Tolerance: 20%; Voltage: 16V; Package: 0201; Distributor_name: DIGIKEY; Distributor_part_number: 490-18654-1-ND; Library Ref: CAP; Height: 0.39MM; Weight: 0.33mg; Temperature: -55°C+85°C; Datasheet: Y:\MIS_DATABASE\DATASHEETS\CAPACITORS\GRM033R61C105ME15.PDF; Crtd /date: ALVY/260520; Chkd/date: MANIRAJA/300520; MECHANICAL 3D STEP FILE: CAP0201_0-5; Library Path: Y:\MIS_DATABASE\Library\ALTIUM_TOOL\SCHEMATICS_PARTS\MS_DISCRETE_Library.schlib; Footprint Path: Y:\MIS_DATABASE\Library\ALTIUM_TOOL\PCB_FOOTPRINTS\Altium_Footprint_Lib.PcbLib
C256 C258 C269 C276 = CAP_Dup2: CAP CERAMIC 1uF 16V 20% X5R 0201; Part_type: CAPACITORS\CERAMIC; Mfr_part_number: GRM033R61C105ME15D; Mfr_name: MURATA; Mistral Part No: 120018090038-R; Custom_Duty: 15%; Customs_HS_Code: 85322990; Wattage: NA; Project: QCS610_NANOSOM; PCB Footprint: CAP0201_0-5; Footprint Path: Y:\MIS_DATABASE\Library\ALTIUM_TOOL\PCB_FOOTPRINTS\Altium_Footprint_Lib.PcbLib; Library Path: Y:\MIS_DATABASE\Library\ALTIUM_TOOL\SCHEMATICS_PARTS\MS_DISCRETE_Library.schlib; MECHANICAL 3D STEP FILE: CAP0201_0-5; Chkd/date: MANIRAJA/300520; Crtd /date: ALVY/260520; Datasheet: Y:\MIS_DATABASE\DATASHEETS\CAPACITORS\GRM033R61C105ME15.PDF; Temperature: -55°C+85°C; Weight: 0.33mg; Height: 0.39MM; Library Ref: CAP; Distributor_part_number: 490-18654-1-ND; Distributor_name: DIGIKEY; Package: 0201; Voltage: 16V; Tolerance: 20%; Footprint Ref: CAP0201_0-5
FL3 FL9 FL14 = EMIFILTER_IND: IND FERRITE BEAD CHIP 120E 2A 0402; Mistral Part No: 130013060022-R; Mfr_name: MURATA; Mfr_part_number: BLM15PX121SN1D; Part_type: INDUCTOR; Project: GEN_3-8; Tolerance: 25%; Voltage: NA; Customs_HS_Code: 85369090; Custom_Duty: 24%; Footprint Ref: EMIFIL_BLM15A_0402_0-6; Wattage: NA; Package: 0402; Distributor_name: DIGIKEY; Distributor_part_number: 490-9656-1-ND; Library Ref: EMIFILTER_IND; Height: 0.55MM; Weight: 1mg; Temperature: -55°C+125°C; Datasheet: Y:\MIS_DATABASE\DATASHEETS\DISCRETES\INDUCTORS\BLM15-SN1-SER.PDF; Crtd /date: USMAN/170613; Chkd/date: NAVEED/241114; MECHANICAL 3D STEP FILE: EMIFIL_BLM15A_0402_0-6; Library Path: Y:\MIS_DATABASE\Library\ALTIUM_TOOL\SCHEMATICS_PARTS\MS_FILTER_Library.schlib; Footprint Path: Y:\MIS_DATABASE\Library\ALTIUM_TOOL\PCB_FOOTPRINTS\Altium_Footprint_Lib.PcbLib; PCB Footprint: EMIFIL_BLM15A_0402_0-6
FL4 = EMIFILTER_IND: FERRITE CHIP 26E 6A 0603; Mistral Part No: 130013100028-R; Mfr_name: MURATA; Mfr_part_number: BLM18SG260TN1D; Part_type: FILTER; Project: DTRM_SBAND; Tolerance: 25%; Voltage: NA; Customs_HS_Code: 85412900; Custom_Duty: 15%; Wattage: NA; Package: 0603; Distributor_name: DIGIKEY; Distributor_part_number: 490-3995-1-ND; Library Ref: EMIFILTER_IND; Height: 0.65MM; Weight: 2mg; Temperature: -55°C+125°C; Datasheet: Y:\MIS_DATABASE\DATASHEETS\DISCRETES\INDUCTORS\BLM18K-SERIES.PDF; Crtd /date: USMAN/251013; Chkd/date: NAVEED/190115; MECHANICAL 3D STEP FILE: EMIFIL_BLM18K_0603_0-7; PCB Footprint: EMIFIL_BLM18K_0603_0-7
FL5 FL6 FL13 FL16 FL19 = EMIFILTER_IND: IND FERRITE BEAD CHIP 120E 2A 0402; Part_type: INDUCTOR; Mfr_part_number: BLM15PX121SN1D; Mfr_name: MURATA; Mistral Part No: 130013060022-R; Custom_Duty: 24%; Customs_HS_Code: 85369090; Wattage: NA; Tolerance: 25%; Project: GEN_3-8; Footprint Path: Y:\MIS_DATABASE\Library\ALTIUM_TOOL\PCB_FOOTPRINTS\Altium_Footprint_Lib.PcbLib; Library Path: Y:\MIS_DATABASE\Library\ALTIUM_TOOL\SCHEMATICS_PARTS\MS_FILTER_Library.schlib; MECHANICAL 3D STEP FILE: EMIFIL_BLM15A_0402_0-6; Chkd/date: NAVEED/241114; Crtd /date: USMAN/170613; Datasheet: Y:\MIS_DATABASE\DATASHEETS\DISCRETES\INDUCTORS\BLM15-SN1-SER.PDF; Temperature: -55°C+125°C; Weight: 1mg; Height: 0.55MM; Library Ref: EMIFILTER_IND; Distributor_part_number: 490-9656-1-ND; Distributor_name: DIGIKEY; Package: 0402; Voltage: NA; Footprint Ref: EMIFIL_BLM15A_0402_0-6; PCB Footprint: EMIFIL_BLM15A_0402_0-6
FL7 FL18 = EMIFILTER_IND: FERRITE CHIP 26E 6A 0603; Part_type: FILTER; Mfr_part_number: BLM18SG260TN1D; Mfr_name: MURATA; Mistral Part No: 130013100028-R; Custom_Duty: 15%; Customs_HS_Code: 85412900; Wattage: NA; Tolerance: 25%; Project: DTRM_SBAND; MECHANICAL 3D STEP FILE: EMIFIL_BLM18K_0603_0-7; Chkd/date: NAVEED/190115; Crtd /date: USMAN/251013; Datasheet: Y:\MIS_DATABASE\DATASHEETS\DISCRETES\INDUCTORS\BLM18K-SERIES.PDF; Temperature: -55°C+125°C; Weight: 2mg; Height: 0.65MM; Library Ref: EMIFILTER_IND; Distributor_part_number: 490-3995-1-ND; Distributor_name: DIGIKEY; Package: 0603; Voltage: NA; PCB Footprint: EMIFIL_BLM18K_0603_0-7
R108 = RESISTOR_Dup6: RES 11K 1/16W 1% 0402; Mistral Part No: 110015110012-R; Mfr_name: YAGEO AMERICA; Mfr_part_number: RC0402FR-0711KL; Part_type: RESISTORS\FIXED; Project: TI_VLAN_SWITCH; Voltage: NA; Customs_HS_Code: 85332119; Custom_Duty: 15%; Library Ref: RESISTOR; Tolerance: 1%; Wattage: 1/16W; Package: 0402; Distributor_name: DIGIKEY; Distributor_part_number: 311-11.0KLRCT-ND; Height: 0.40MM; Weight: 0.65mg; Temperature: -55°C+155°C; Datasheet: Y:\MIS_DATABASE\DATASHEETS\RESISTORS\RCXXXXL-SER_MAR18.PDF; Crtd /date: VASANTHA/251115; Chkd/date: VASANTHA/251115; MECHANICAL 3D STEP FILE: RES0402_0-5; Footprint Ref: RES0402_0-5; Library Path: Y:\MIS_DATABASE\Library\ALTIUM_TOOL\SCHEMATICS_PARTS\MS_DISCRETE_Library.schlib; Footprint Path: Y:\MIS_DATABASE\Library\ALTIUM_TOOL\PCB_FOOTPRINTS\Altium_Footprint_Lib.PcbLib; PCB Footprint: RES0402_0-5
R375 = RESISTOR_Dup4: RES 100K 1/10W 1% 0402; Part_type: RESISTORS\FIXED; Mfr_part_number: ERJ-2RKF1003X; Mfr_name: PANASONIC-ECG; Mistral Part No: 110009030187-R; Custom_Duty: 15%; Customs_HS_Code: 85332119; Voltage: NA; Project: J32; Chkd/date: VASANTHA/201216; Crtd /date: MAZHAR/130306; Datasheet: Y:\MIS_DATABASE\DATASHEETS\RESISTORS\PAN-ERJSER_NOV17.PDF; Temperature: -55°C+155°C; Weight: 0.8mg; Height: 0.40MM; Distributor_part_number: P100KLCT-ND; Distributor_name: DIGIKEY; Package: 0402; Wattage: 1/10W; Tolerance: 1%; MECHANICAL 3D STEP FILE: RES0402_0-5; Library Ref: RESISTOR; Footprint Ref: RES0402_0-5; Library Path: Y:\MIS_DATABASE\Library\ALTIUM_TOOL\SCHEMATICS_PARTS\MS_DISCRETE_Library.schlib; Footprint Path: Y:\MIS_DATABASE\Library\ALTIUM_TOOL\PCB_FOOTPRINTS\Altium_Footprint_Lib.PcbLib; PCB Footprint: RES0402_0-5
U12#1 = AM62-EVM_BGA425_Dup1: IC AM62 SoC MICROPROCESSOR BGA425; Part_type: ICS\DIGITAL\MICROPROCESSOR; Mfr_name: TEXAS INSTRUMENTS; Mistral Part No: 141221060001; Custom_Duty: 15%; Customs_HS_Code: 85423100; Wattage: NA; Project: AM62_EVM_BRD; Footprint Path: Y:\MIS_DATABASE\Library\ALTIUM_TOOL\PCB_FOOTPRINTS\Altium_Footprint_Lib.PcbLib; Library Path: Y:\MIS_DATABASE\Library\ALTIUM_TOOL\SCHEMATICS_PARTS\MS_MICROPROCESSOR_Library.schlib; MECHANICAL 3D STEP FILE: BGA425_19-68_510X510_0-7; RoHS: NA; Chkd/date: ALVY/110621; Crtd /date: MANIRAJA/110621; Datasheet: Y:\MIS_DATABASE\DATASHEETS\ICS\DIGITAL\MICROCONTROLLER\AM62-SoC_SVB.PDF; Temperature: NA; Weight: NA; Height: 0.65MM; Footprint Ref: BGA425_19-68_510X510_0-7; Library Ref: AM62-EVM_BGA425; Distributor_part_number: NA; Distributor_name: NA; Package: BGA425; Voltage: NA; Tolerance: NA; Mfr_part_number: AM62 SoC_EVM; PCB Footprint: BGA425_19-68_510X510_0-7
U12#2 = AM62-EVM_BGA425: IC AM62 SoC MICROPROCESSOR BGA425; Part_type: ICS\DIGITAL\MICROPROCESSOR; Mfr_name: TEXAS INSTRUMENTS; Mistral Part No: 141221060001; Custom_Duty: 15%; Customs_HS_Code: 85423100; Wattage: NA; Project: AM62_EVM_BRD; PCB Footprint: BGA425_19-68_510X510_0-7; Footprint Path: Y:\MIS_DATABASE\Library\ALTIUM_TOOL\PCB_FOOTPRINTS\Altium_Footprint_Lib.PcbLib; Library Path: Y:\MIS_DATABASE\Library\ALTIUM_TOOL\SCHEMATICS_PARTS\MS_MICROPROCESSOR_Library.schlib; MECHANICAL 3D STEP FILE: BGA425_19-68_510X510_0-7; RoHS: NA; Chkd/date: ALVY/110621; Crtd /date: MANIRAJA/110621; Datasheet: Y:\MIS_DATABASE\DATASHEETS\ICS\DIGITAL\MICROCONTROLLER\AM62-SoC_SVB.PDF; Temperature: NA; Weight: NA; Height: 0.65MM; Footprint Ref: BGA425_19-68_510X510_0-7; Library Ref: AM62-EVM_BGA425; Distributor_part_number: NA; Distributor_name: NA; Package: BGA425; Voltage: NA; Tolerance: NA; Mfr_part_number: AM62 SoC_EVM

## Sheet 15.SchDoc
size 513 x 386 mm
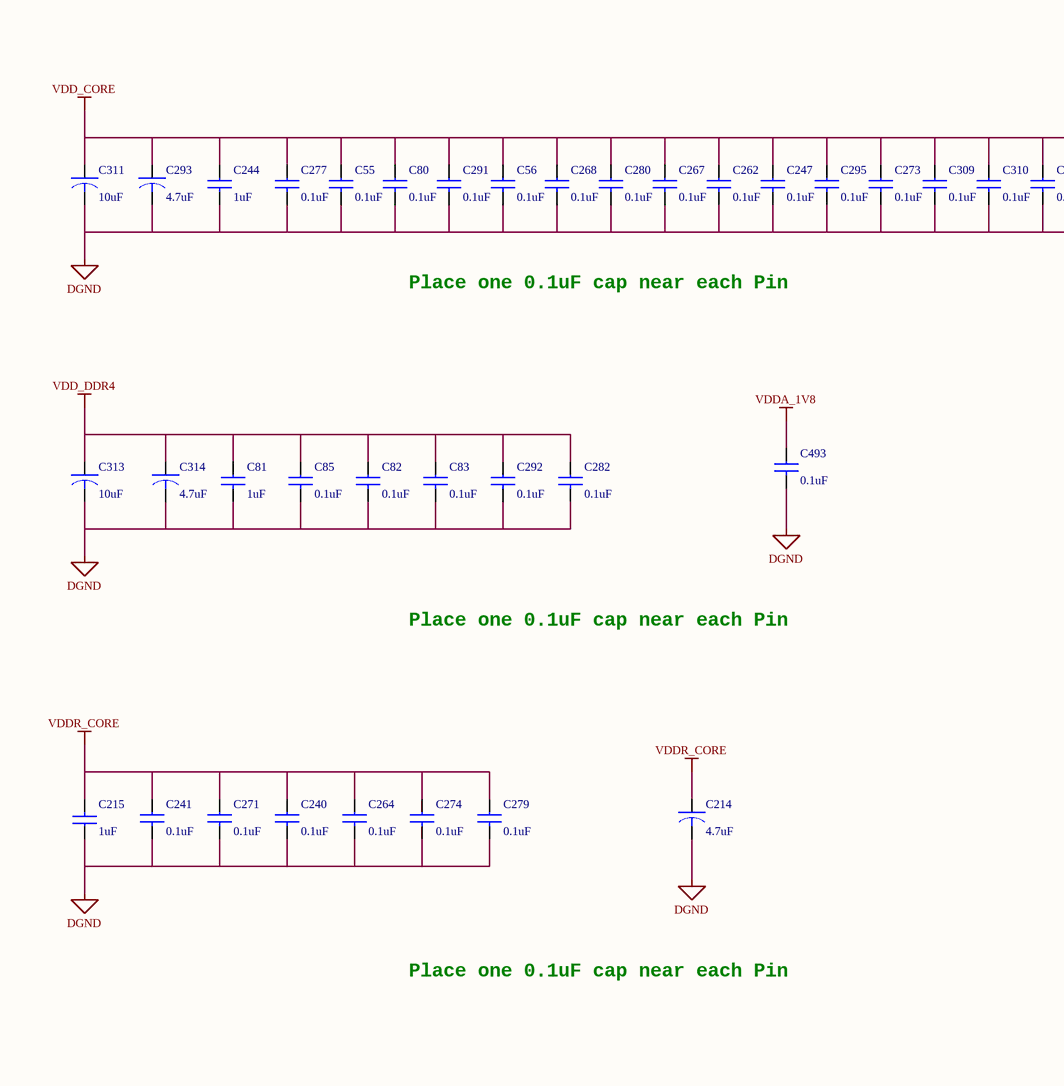
[diagram p19: 15.SchDoc, left]
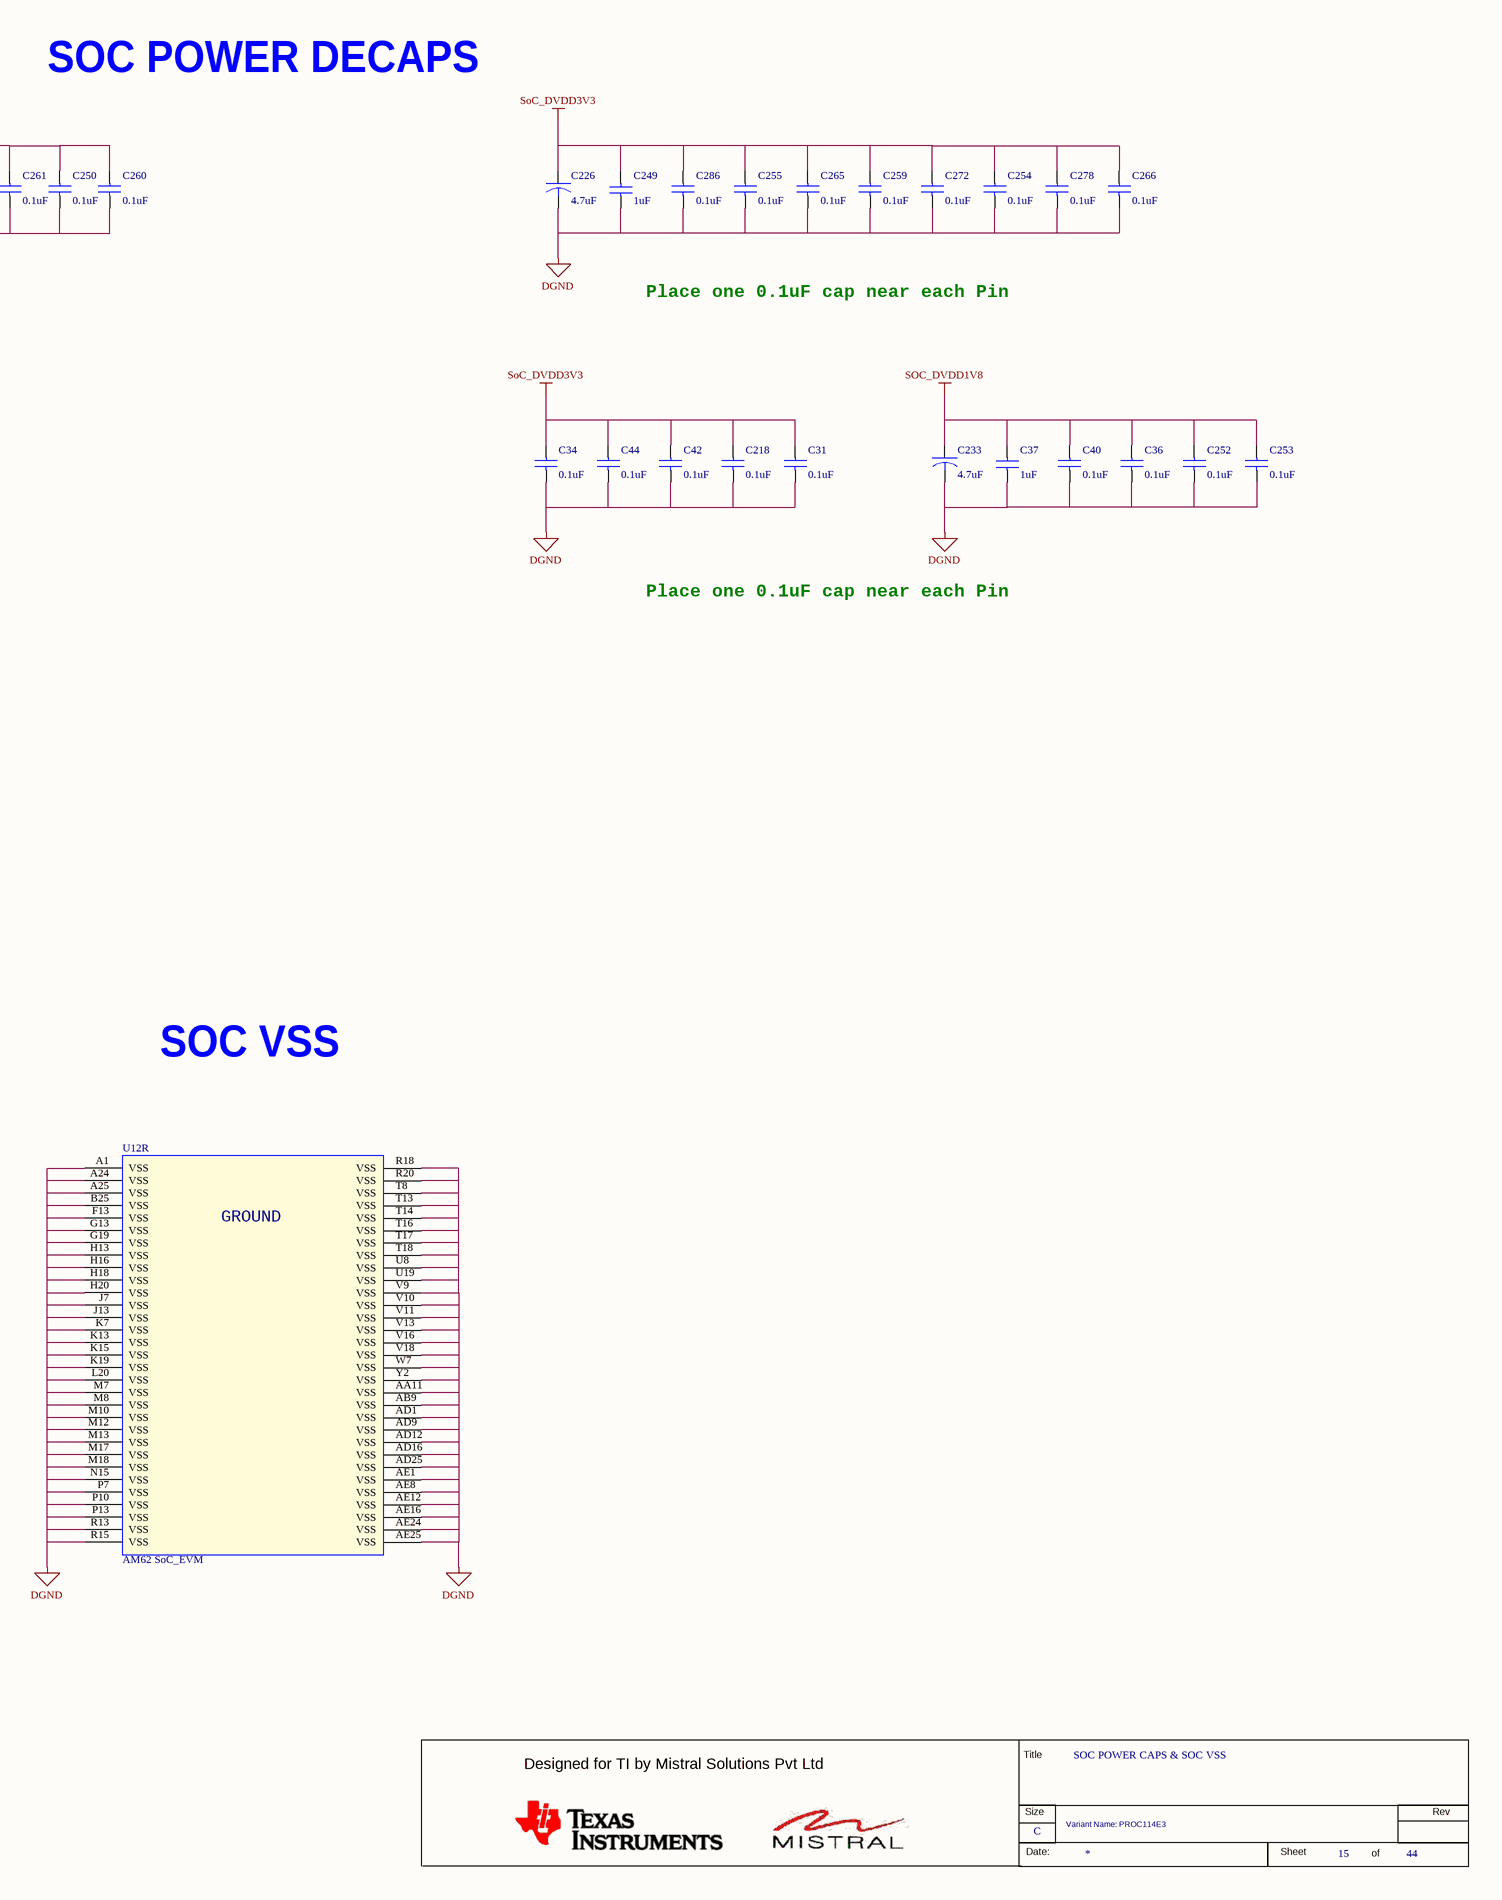
[diagram p20: 15.SchDoc, right]

### Parts
(Parts that share a designator on the sheet are numbered #1, #2 ... from top to bottom, then left to right.)
*#15  Title: SOC POWER CAPS & SOC VSS  Page Size: C  Page Number: 15  Page Count: 44  Variant Name: PROC114E3  (hidden comment: MISTRAL_TITLEBLK_CSIZE)  (graphical)
C31  0.1uF  [CAP0201_0-5]
C34  0.1uF  [CAP0201_0-5]
C36  0.1uF  [CAP0201_0-5]
C37  1uF  [CAP0201_0-5]
C40  0.1uF  [CAP0201_0-5]
C42  0.1uF  [CAP0201_0-5]
C44  0.1uF  [CAP0201_0-5]
C55  0.1uF  [CAP0201_0-5]
C56  0.1uF  [CAP0201_0-5]
C80  0.1uF  [CAP0201_0-5]
C81  1uF  [CAP0201_0-5]
C82  0.1uF  [CAP0201_0-5]
C83  0.1uF  [CAP0201_0-5]
C85  0.1uF  [CAP0201_0-5]
C214  4.7uF  [CAP0402_0-75]
C215  1uF  [CAP0201_0-5]
C218  0.1uF  [CAP0201_0-5]
C226  4.7uF  [CAP0402_0-75]
C233  4.7uF  [CAP0402_0-75]
C240  0.1uF  [CAP0201_0-5]
C241  0.1uF  [CAP0201_0-5]
C244  1uF  [CAP0201_0-5]
C247  0.1uF  [CAP0201_0-5]
C249  1uF  [CAP0201_0-5]
C250  0.1uF  [CAP0201_0-5]
C252  0.1uF  [CAP0201_0-5]
C253  0.1uF  [CAP0201_0-5]
C254  0.1uF  [CAP0201_0-5]
C255  0.1uF  [CAP0201_0-5]
C259  0.1uF  [CAP0201_0-5]
C260  0.1uF  [CAP0201_0-5]
C261  0.1uF  [CAP0201_0-5]
C262  0.1uF  [CAP0201_0-5]
C264  0.1uF  [CAP0201_0-5]
C265  0.1uF  [CAP0201_0-5]
C266  0.1uF  [CAP0201_0-5]
C267  0.1uF  [CAP0201_0-5]
C268  0.1uF  [CAP0201_0-5]
C271  0.1uF  [CAP0201_0-5]
C272  0.1uF  [CAP0201_0-5]
C273  0.1uF  [CAP0201_0-5]
C274  0.1uF  [CAP0201_0-5]
C277  0.1uF  [CAP0201_0-5]
C278  0.1uF  [CAP0201_0-5]
C279  0.1uF  [CAP0201_0-5]
C280  0.1uF  [CAP0201_0-5]
C282  0.1uF  [CAP0201_0-5]
C286  0.1uF  [CAP0201_0-5]
C291  0.1uF  [CAP0201_0-5]
C292  0.1uF  [CAP0201_0-5]
C293  4.7uF  [CAP0402_0-75]
C295  0.1uF  [CAP0201_0-5]
C309  0.1uF  [CAP0201_0-5]
C310  0.1uF  [CAP0201_0-5]
C311  10uF  [CAP0402_0-75]
C313  10uF  [CAP0402_0-75]
C314  4.7uF  [CAP0402_0-75]
C493  0.1uF  [CAP0201_0-5]
U12#2  AM62 SoC_EVM  [BGA425_19-68_510X510_0-7]  (part R of 18)

### Nets
DGND: C31.2 C34.2 C36.2 C37.1 C40.2 C42.2 C44.2 C55.2 C56.2 C80.2 C81.2 C82.2 C83.2 C85.2 C214.2 C215.1 C218.2 C226.2 C233.2 C240.2 C241.2 C244.2 C247.2 C249.1 C250.2 C252.2 C253.2 C254.2 C255.2 C259.2 C260.2 C261.2 C262.2 C264.2 C265.2 C266.2 C267.2 C268.2 C271.2 C272.2 C273.2 C274.2 C277.2 C278.2 C279.2 C280.2 C282.2 C286.2 C291.2 C292.2 C293.2 C295.2 C309.2 C310.2 C311.2 C313.2 C314.2 C493.2 U12#2.A1(VSS) U12#2.A24(VSS) U12#2.A25(VSS) U12#2.AA11(VSS) U12#2.AB9(VSS) U12#2.AD1(VSS) U12#2.AD9(VSS) U12#2.AD12(VSS) U12#2.AD16(VSS) U12#2.AD25(VSS) U12#2.AE1(VSS) U12#2.AE8(VSS) U12#2.AE12(VSS) U12#2.AE16(VSS) U12#2.AE24(VSS) U12#2.AE25(VSS) U12#2.B25(VSS) U12#2.F13(VSS) U12#2.G13(VSS) U12#2.G19(VSS) U12#2.H13(VSS) U12#2.H16(VSS) U12#2.H18(VSS) U12#2.H20(VSS) U12#2.J7(VSS) U12#2.J13(VSS) U12#2.K7(VSS) U12#2.K13(VSS) U12#2.K15(VSS) U12#2.K19(VSS) U12#2.L20(VSS) U12#2.M7(VSS) U12#2.M8(VSS) U12#2.M10(VSS) U12#2.M12(VSS) U12#2.M13(VSS) U12#2.M17(VSS) U12#2.M18(VSS) U12#2.N15(VSS) U12#2.P7(VSS) U12#2.P10(VSS) U12#2.P13(VSS) U12#2.R13(VSS) U12#2.R15(VSS) U12#2.R18(VSS) U12#2.R20(VSS) U12#2.T8(VSS) U12#2.T13(VSS) U12#2.T14(VSS) U12#2.T16(VSS) U12#2.T17(VSS) U12#2.T18(VSS) U12#2.U8(VSS) U12#2.U19(VSS) U12#2.V9(VSS) U12#2.V10(VSS) U12#2.V11(VSS) U12#2.V13(VSS) U12#2.V16(VSS) U12#2.V18(VSS) U12#2.W7(VSS) U12#2.Y2(VSS)
SOC_DVDD1V8: C36.1 C37.2 C40.1 C233.1 C252.1 C253.1
SoC_DVDD3V3: C31.1 C34.1 C42.1 C44.1 C218.1 C226.1 C249.2 C254.1 C255.1 C259.1 C265.1 C266.1 C272.1 C278.1 C286.1
VDD_CORE: C55.1 C56.1 C80.1 C244.1 C247.1 C250.1 C260.1 C261.1 C262.1 C267.1 C268.1 C273.1 C277.1 C280.1 C291.1 C293.1 C295.1 C309.1 C310.1 C311.1
VDD_DDR4: C81.1 C82.1 C83.1 C85.1 C282.1 C292.1 C313.1 C314.1
VDDA_1V8: C493.1
VDDR_CORE: C214.1 C215.2 C240.1 C241.1 C264.1 C271.1 C274.1 C279.1

### Notes on the sheet
- SOC POWER DECAPS
- Place one 0.1uF cap near each Pin
- SOC VSS
- (in symbol AM62-EVM_BGA425, part R) GROUND
- (in symbol MISTRAL_TITLEBLK_CSIZE) Title; Designed for TI by Mistral Solutions Pvt Ltd; Size; Rev; Date:; Sheet; of

### Library data of the parts
*#15 = MISTRAL_TITLEBLK_CSIZE: RevCode: E3; Issue: 1.0; Page Create Date: March  8, 1995; Page Modify Date: *; Schematic Page Count: 44; Schematic Page Number: 15
C31 C36 C44 C55 C56 C80 C83 C218 C247 C253-C255 C262 C265 C266 C277 C279 C280 C282 C291 C295 C493 = CAP_Dup2: as C54 on sheet 14; PCB Footprint: CAP0201_0-5; Footprint Path: Y:\MIS_DATABASE\Library\ALTIUM_TOOL\PCB_FOOTPRINTS\Altium_Footprint_Lib.PcbLib; Library Path: Y:\MIS_DATABASE\Library\ALTIUM_TOOL\SCHEMATICS_PARTS\MS_DISCRETE_Library.schlib; Footprint Ref: CAP0201_0-5; MECHANICAL 3D STEP FILE: CAP0201_0-5; Chkd/date: MANIRAJA/230118; Crtd /date: MANIRAJA/230118; Datasheet: Y:\MIS_DATABASE\DATASHEETS\CAPACITORS\GRM033R61C104KE14.PDF; Temperature: -55°C+85°C; Weight: 0.33mg; Height: 0.33MM; Distributor_part_number: 490-14305-1-ND; Distributor_name: DIGIKEY; Package: 0201; Voltage: 16V; Tolerance: 10%; Library Ref: CAP
C34 C40 C42 C82 C85 C240 C241 C250 C252 C259-C261 C264 C267 C268 C271-C274 C278 C286 C292 C309 C310 = CAP_Dup2: as C221 on sheet 14; PCB Footprint: CAP0201_0-5; Library Ref: CAP; Tolerance: 10%; Voltage: 16V; Package: 0201; Distributor_name: DIGIKEY; Distributor_part_number: 490-14305-1-ND; Height: 0.33MM; Weight: 0.33mg; Temperature: -55°C+85°C; Datasheet: Y:\MIS_DATABASE\DATASHEETS\CAPACITORS\GRM033R61C104KE14.PDF; Crtd /date: MANIRAJA/230118; Chkd/date: MANIRAJA/230118; MECHANICAL 3D STEP FILE: CAP0201_0-5; Footprint Ref: CAP0201_0-5; Library Path: Y:\MIS_DATABASE\Library\ALTIUM_TOOL\SCHEMATICS_PARTS\MS_DISCRETE_Library.schlib; Footprint Path: Y:\MIS_DATABASE\Library\ALTIUM_TOOL\PCB_FOOTPRINTS\Altium_Footprint_Lib.PcbLib
C37 C215 C244 = CAP_Dup2: as C239 on sheet 14; PCB Footprint: CAP0201_0-5; Footprint Path: Y:\MIS_DATABASE\Library\ALTIUM_TOOL\PCB_FOOTPRINTS\Altium_Footprint_Lib.PcbLib; Library Path: Y:\MIS_DATABASE\Library\ALTIUM_TOOL\SCHEMATICS_PARTS\MS_DISCRETE_Library.schlib; MECHANICAL 3D STEP FILE: CAP0201_0-5; Tolerance: 20%; Voltage: 16V; Package: 0201; Distributor_name: DIGIKEY; Distributor_part_number: 490-18654-1-ND; Height: 0.39MM; Weight: 0.33mg; Temperature: -55°C+85°C; Datasheet: Y:\MIS_DATABASE\DATASHEETS\CAPACITORS\GRM033R61C105ME15.PDF; Crtd /date: ALVY/260520; Chkd/date: MANIRAJA/300520; Library Ref: CAP; Footprint Ref: CAP0201_0-5
C81 C249 = CAP_Dup2: as C256 on sheet 14; PCB Footprint: CAP0201_0-5; Footprint Ref: CAP0201_0-5; Library Ref: CAP; Chkd/date: MANIRAJA/300520; Crtd /date: ALVY/260520; Datasheet: Y:\MIS_DATABASE\DATASHEETS\CAPACITORS\GRM033R61C105ME15.PDF; Temperature: -55°C+85°C; Weight: 0.33mg; Height: 0.39MM; Distributor_part_number: 490-18654-1-ND; Distributor_name: DIGIKEY; Package: 0201; Voltage: 16V; Tolerance: 20%; MECHANICAL 3D STEP FILE: CAP0201_0-5; Library Path: Y:\MIS_DATABASE\Library\ALTIUM_TOOL\SCHEMATICS_PARTS\MS_DISCRETE_Library.schlib; Footprint Path: Y:\MIS_DATABASE\Library\ALTIUM_TOOL\PCB_FOOTPRINTS\Altium_Footprint_Lib.PcbLib
C214 C293 C314 = CAP_Dup1: as C48 on sheet 14; PCB Footprint: CAP0402_0-75; Footprint Ref: CAP0402_0-75; Tolerance: 20%; Voltage: 10V; Package: 0402; Distributor_name: DIGIKEY; Distributor_part_number: 490-14306-1-ND; Library Ref: CAP; Height: 0.65MM; Weight: 14mg; Temperature: -55°C+85°C; Datasheet: Y:\MIS_DATABASE\DATASHEETS\CAPACITORS\GRM155R61A475MEAAD.PDF; Crtd /date: ALVY/110718; Chkd/date: MANIRAJA/110718; MECHANICAL 3D STEP FILE: CAP0402_0-75; Library Path: Y:\MIS_DATABASE\Library\ALTIUM_TOOL\SCHEMATICS_PARTS\MS_DISCRETE_Library.schlib; Footprint Path: Y:\MIS_DATABASE\Library\ALTIUM_TOOL\PCB_FOOTPRINTS\Altium_Footprint_Lib.PcbLib
C226 C233 = CAP_Dup1: as C41 on sheet 14; PCB Footprint: CAP0402_0-75; Footprint Path: Y:\MIS_DATABASE\Library\ALTIUM_TOOL\PCB_FOOTPRINTS\Altium_Footprint_Lib.PcbLib; Library Path: Y:\MIS_DATABASE\Library\ALTIUM_TOOL\SCHEMATICS_PARTS\MS_DISCRETE_Library.schlib; MECHANICAL 3D STEP FILE: CAP0402_0-75; Chkd/date: MANIRAJA/110718; Crtd /date: ALVY/110718; Datasheet: Y:\MIS_DATABASE\DATASHEETS\CAPACITORS\GRM155R61A475MEAAD.PDF; Temperature: -55°C+85°C; Weight: 14mg; Height: 0.65MM; Library Ref: CAP; Distributor_part_number: 490-14306-1-ND; Distributor_name: DIGIKEY; Package: 0402; Voltage: 10V; Tolerance: 20%; Footprint Ref: CAP0402_0-75
C311 = CAP_Dup1: CAP CERAMIC 10uF 10V 20% X5R 0402; Part_type: CAPACITORS\CERAMIC; Mfr_part_number: GRM155R61A106ME11D; Mfr_name: MURATA; Mistral Part No: 120013110019-R; Custom_Duty: 15%; Customs_HS_Code: 85322990; Wattage: NA; Project: QCS610_NANOSOM; PCB Footprint: CAP0402_0-75; Footprint Path: Y:\MIS_DATABASE\Library\ALTIUM_TOOL\PCB_FOOTPRINTS\Altium_Footprint_Lib.PcbLib; Library Path: Y:\MIS_DATABASE\Library\ALTIUM_TOOL\SCHEMATICS_PARTS\MS_DISCRETE_Library.schlib; MECHANICAL 3D STEP FILE: CAP0402_0-75; Chkd/date: MANIRAJA/300520; Crtd /date: ALVY/260520; Datasheet: Y:\MIS_DATABASE\DATASHEETS\CAPACITORS\MURATA-GXX-SER_NOV17.PDF; Temperature: -55°C+85°C; Weight: 3.1mg; Height: 0.55MM; Library Ref: CAP; Distributor_part_number: 490-GRM155R61A106ME11DTR-ND; Distributor_name: DIGIKEY; Package: 0402; Voltage: 10V; Tolerance: 20%; Footprint Ref: CAP0402_0-75
C313 = CAP_Dup1: CAP CERAMIC 10uF 10V 20% X5R 0402; Mistral Part No: 120013110019-R; Mfr_name: MURATA; Mfr_part_number: GRM155R61A106ME11D; Part_type: CAPACITORS\CERAMIC; Project: QCS610_NANOSOM; Wattage: NA; Customs_HS_Code: 85322990; Custom_Duty: 15%; PCB Footprint: CAP0402_0-75; Footprint Ref: CAP0402_0-75; Tolerance: 20%; Voltage: 10V; Package: 0402; Distributor_name: DIGIKEY; Distributor_part_number: 490-GRM155R61A106ME11DTR-ND; Library Ref: CAP; Height: 0.55MM; Weight: 3.1mg; Temperature: -55°C+85°C; Datasheet: Y:\MIS_DATABASE\DATASHEETS\CAPACITORS\MURATA-GXX-SER_NOV17.PDF; Crtd /date: ALVY/260520; Chkd/date: MANIRAJA/300520; MECHANICAL 3D STEP FILE: CAP0402_0-75; Library Path: Y:\MIS_DATABASE\Library\ALTIUM_TOOL\SCHEMATICS_PARTS\MS_DISCRETE_Library.schlib; Footprint Path: Y:\MIS_DATABASE\Library\ALTIUM_TOOL\PCB_FOOTPRINTS\Altium_Footprint_Lib.PcbLib
U12#2 = AM62-EVM_BGA425: as U12#2 on sheet 14; PCB Footprint: BGA425_19-68_510X510_0-7; Footprint Path: Y:\MIS_DATABASE\Library\ALTIUM_TOOL\PCB_FOOTPRINTS\Altium_Footprint_Lib.PcbLib; Library Path: Y:\MIS_DATABASE\Library\ALTIUM_TOOL\SCHEMATICS_PARTS\MS_MICROPROCESSOR_Library.schlib; MECHANICAL 3D STEP FILE: BGA425_19-68_510X510_0-7; RoHS: NA; Chkd/date: ALVY/110621; Crtd /date: MANIRAJA/110621; Datasheet: Y:\MIS_DATABASE\DATASHEETS\ICS\DIGITAL\MICROCONTROLLER\AM62-SoC_SVB.PDF; Temperature: NA; Weight: NA; Height: 0.65MM; Footprint Ref: BGA425_19-68_510X510_0-7; Library Ref: AM62-EVM_BGA425; Distributor_part_number: NA; Distributor_name: NA; Package: BGA425; Voltage: NA; Tolerance: NA; Mfr_part_number: AM62 SoC_EVM